# EAGLE design raspberry_pi_v002 (EAGLE 9.5.2)
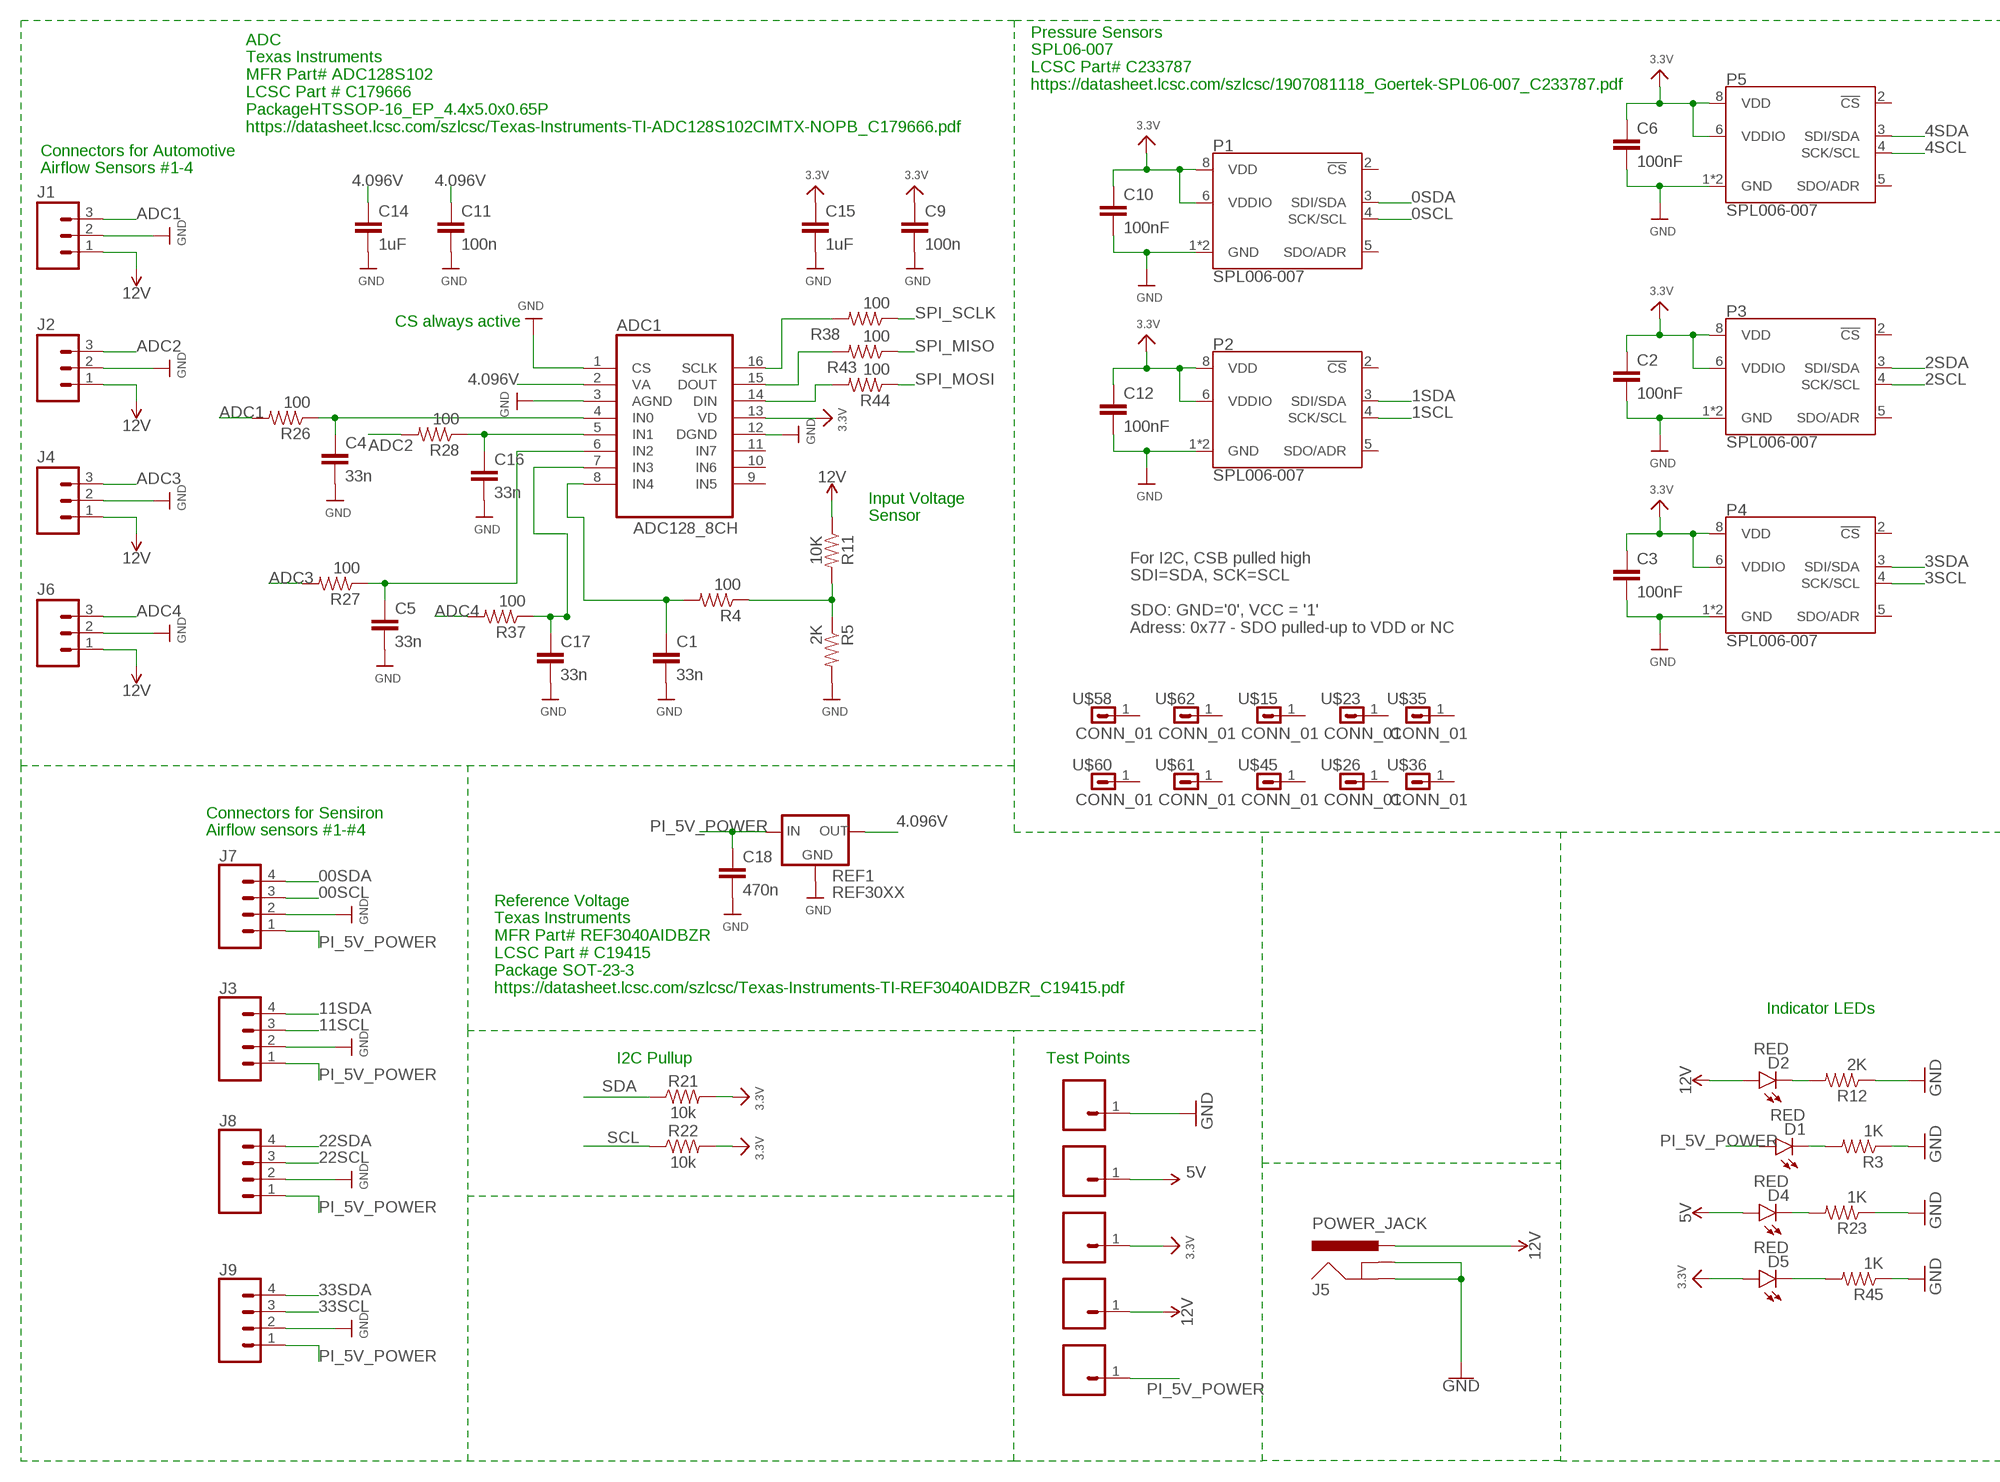
[diagram p0: schematic, sheet 1, part 1 of 2]
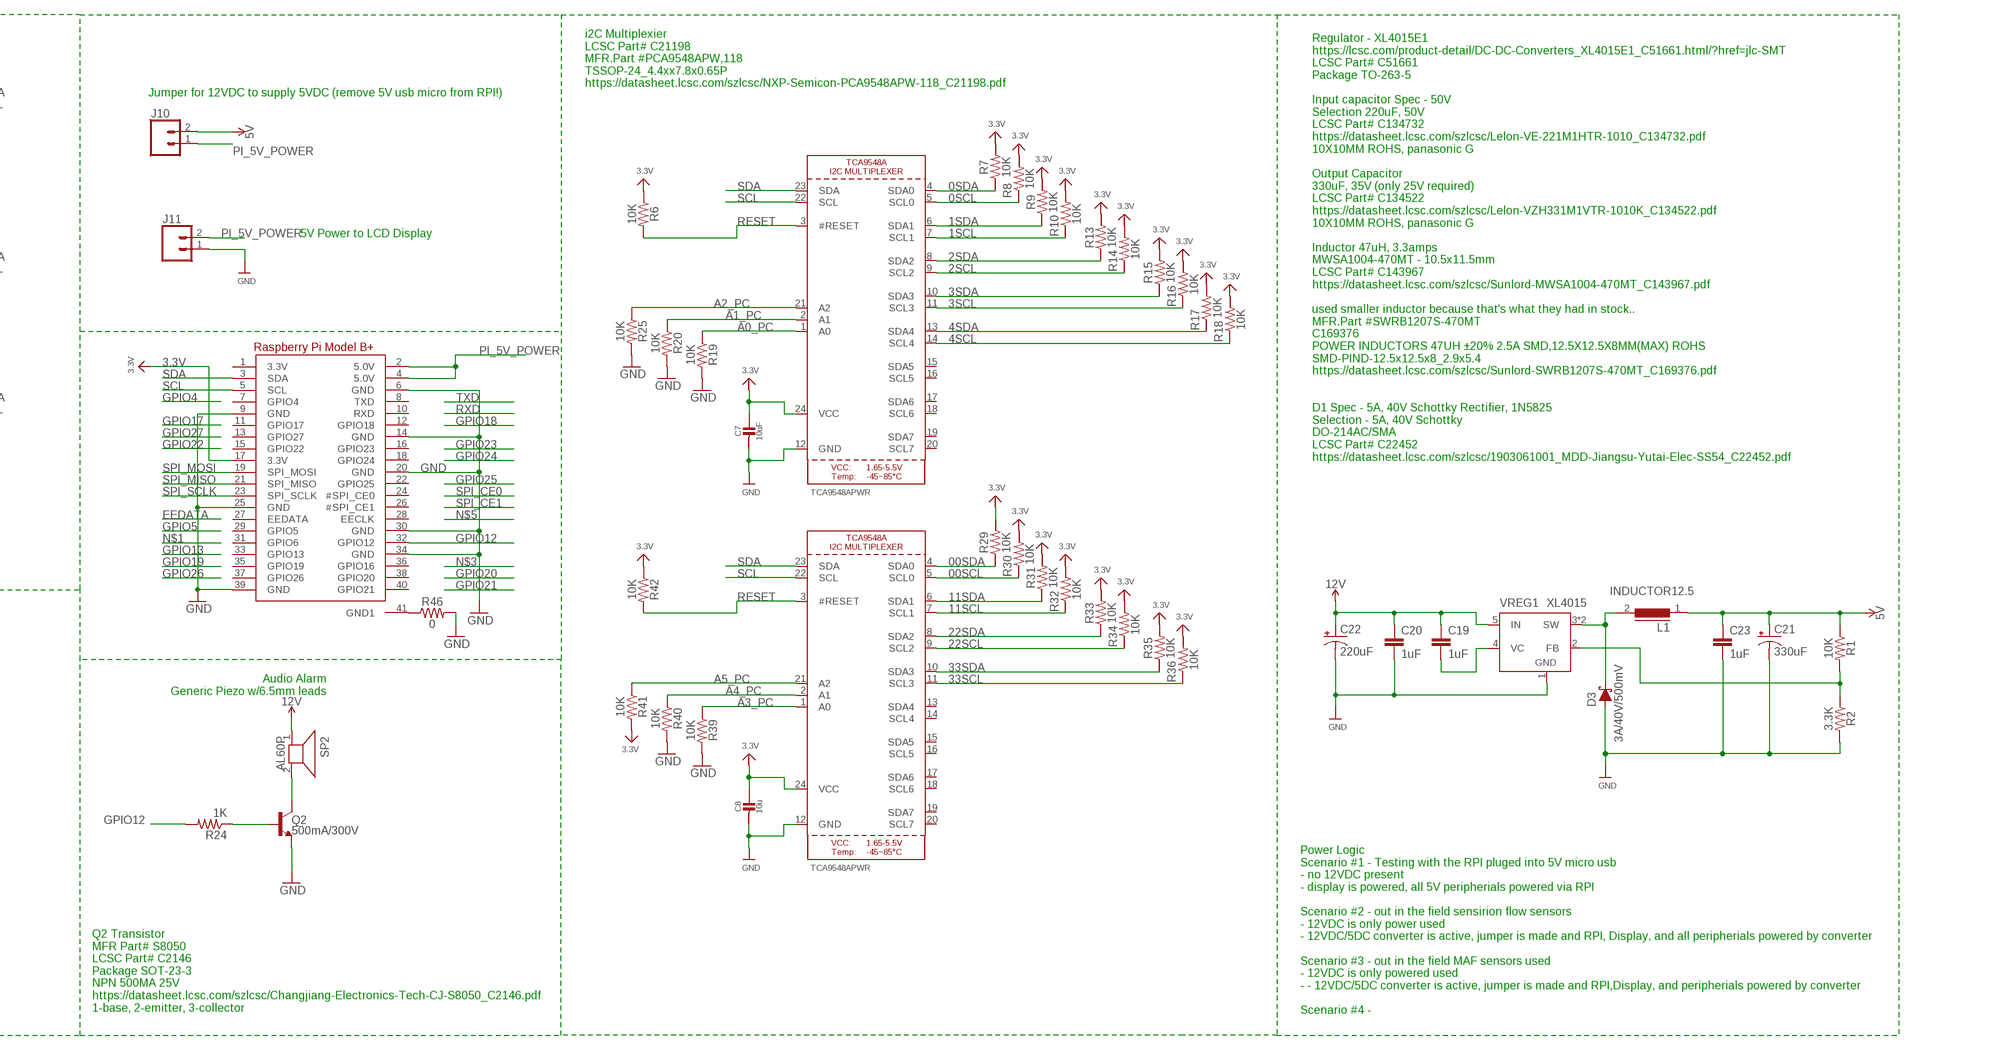
[diagram p1: schematic, sheet 1, part 2 of 2]

## Parts
ADC1  ADC128_8CH  [TSSOP16]
C1  33n  CAP-0805  [0805]
C2  100nF  CAP-0805  [0805]
C3  100nF  CAP-0805  [0805]
C4  33n  CAP-0805  [0805]
C5  33n  CAP-0805  [0805]
C6  100nF  CAP-0805  [0805]
C7  10uF  CAP_CERAMIC0805-NOOUTLINE  [0805-NO]
C8  10u  CAP_CERAMIC0805-NOOUTLINE  [0805-NO]
C9  100n  CAP-0805  [0805]
C10  100nF  CAP-0805  [0805]
C11  100n  CAP-0805  [0805]
C12  100nF  CAP-0805  [0805]
C14  1uF  CAP-0805  [0805]
C15  1uF  CAP-0805  [0805]
C16  33n  CAP-0805  [0805]
C17  33n  CAP-0805  [0805]
C18  470n  CAP-0805  [0805]
C19  1uF  CAP-0805  [0805]
C20  1uF  CAP-0805  [0805]
C21  330uF  560UF-PANASONIC_G-25V-20%  [PANASONIC_G]
C22  220uF  560UF-PANASONIC_G-25V-20%  [PANASONIC_G]
C23  1uF  CAP-0805  [0805]
D1  RED  LED-RED1206  [LED-1206]
D2  RED  LED-RED1206  [LED-1206]
D3  3A/40V/500mV  DIODE-SCHOTTKY-B340A  [SMA-DIODE]
D4  RED  LED-RED1206  [LED-1206]
D5  RED  LED-RED1206  [LED-1206]
J1  M03SCREW  [SCREWTERMINAL-3.5MM-3]
J2  M03SCREW  [SCREWTERMINAL-3.5MM-3]
J3  CONN_043.5MM_RA  [1X04_3.5MM_RA]
J4  M03SCREW  [SCREWTERMINAL-3.5MM-3]
J5  POWER_JACK  [POWER_JACK_PTH]
J6  M03SCREW  [SCREWTERMINAL-3.5MM-3]
J7  CONN_043.5MM_RA  [1X04_3.5MM_RA]
J8  CONN_043.5MM_RA  [1X04_3.5MM_RA]
J9  CONN_043.5MM_RA  [1X04_3.5MM_RA]
J10  CONN_02  [1X02]
J11  CONN_025MM  [SCREWTERMINAL-5MM-2]
L1  INDUCTOR12.5  [INDUCTOR_12.5X12.5]
P1  SPL006-007  [LGA-8-2.5X2.0]
P2  SPL006-007  [LGA-8-2.5X2.0]
P3  SPL006-007  [LGA-8-2.5X2.0]
P4  SPL006-007  [LGA-8-2.5X2.0]
P5  SPL006-007  [LGA-8-2.5X2.0]
Q2  500mA/300V  TRANS_NPN-MMBTA42  [SOT23-3]
R1  10K  0.3OHM-0805-1/8W-1%  [0805]
R2  3.3K  0.3OHM-0805-1/8W-1%  [0805]
R3  1K  RESISTOR0805-RES  [0805]
R4  100  RESISTOR0805-RES  [0805]
R5  2K  RESISTOR0805-RES  [0805]
R6  10K  0.3OHM-0805-1/8W-1%  [0805]
R7  10K  0.3OHM-0805-1/8W-1%  [0805]
R8  10K  0.3OHM-0805-1/8W-1%  [0805]
R9  10K  0.3OHM-0805-1/8W-1%  [0805]
R10  10K  0.3OHM-0805-1/8W-1%  [0805]
R11  10K  0.3OHM-0805-1/8W-1%  [0805]
R12  2K  RESISTOR0805-RES  [0805]
R13  10K  0.3OHM-0805-1/8W-1%  [0805]
R14  10K  0.3OHM-0805-1/8W-1%  [0805]
R15  10K  0.3OHM-0805-1/8W-1%  [0805]
R16  10K  0.3OHM-0805-1/8W-1%  [0805]
R17  10K  0.3OHM-0805-1/8W-1%  [0805]
R18  10K  0.3OHM-0805-1/8W-1%  [0805]
R19  10K  0.3OHM-0805-1/8W-1%  [0805]
R20  10K  0.3OHM-0805-1/8W-1%  [0805]
R21  10k  0.3OHM-0805-1/8W-1%  [0805]
R22  10k  0.3OHM-0805-1/8W-1%  [0805]
R23  1K  RESISTOR0805-RES  [0805]
R24  1K  RESISTOR0805-RES  [0805]
R25  10K  0.3OHM-0805-1/8W-1%  [0805]
R26  100  RESISTOR0805-RES  [0805]
R27  100  RESISTOR0805-RES  [0805]
R28  100  RESISTOR0805-RES  [0805]
R29  10K  0.3OHM-0805-1/8W-1%  [0805]
R30  10K  0.3OHM-0805-1/8W-1%  [0805]
R31  10K  0.3OHM-0805-1/8W-1%  [0805]
R32  10K  0.3OHM-0805-1/8W-1%  [0805]
R33  10K  0.3OHM-0805-1/8W-1%  [0805]
R34  10K  0.3OHM-0805-1/8W-1%  [0805]
R35  10K  0.3OHM-0805-1/8W-1%  [0805]
R36  10K  0.3OHM-0805-1/8W-1%  [0805]
R37  100  RESISTOR0805-RES  [0805]
R38  100  RESISTOR0805-RES  [0805]
R39  10K  0.3OHM-0805-1/8W-1%  [0805]
R40  10K  0.3OHM-0805-1/8W-1%  [0805]
R41  10K  0.3OHM-0805-1/8W-1%  [0805]
R42  10K  0.3OHM-0805-1/8W-1%  [0805]
R43  100  RESISTOR0805-RES  [0805]
R44  100  RESISTOR0805-RES  [0805]
R45  1K  RESISTOR0805-RES  [0805]
R46  0  0.3OHM-0805-1/8W-1%  [0805]
REF1  REF30XX  [SOT23-3]
RPI2  MICROBUILDER_RASPBERRYPI_BPLUS_HATSLOTS  [MICROBUILDER_PI_HAT_SLOTS]
SP2  AL60P  [AL60P]
U6  TCA9548APWR  TCA9548A  [TSSOP24]
U7  TCA9548APWR  TCA9548A  [TSSOP24]
U$15  CONN_01  [1X01-#6_MACHINE]
U$20  CONN_0138MILL  [1X01-40MILL]
U$23  CONN_01  [1X01-#6_MACHINE]
U$26  CONN_01  [1X01-#6_MACHINE]
U$31  CONN_0138MILL  [1X01-40MILL]
U$35  CONN_01  [1X01-#6_MACHINE]
U$36  CONN_01  [1X01-#6_MACHINE]
U$40  CONN_0138MILL  [1X01-40MILL]
U$45  CONN_01  [1X01-#6_MACHINE]
U$58  CONN_01  [1X01-#6_MACHINE]
U$59  CONN_0138MILL  [1X01-40MILL]
U$60  CONN_01  [1X01-#6_MACHINE]
U$61  CONN_01  [1X01-#6_MACHINE]
U$62  CONN_01  [1X01-#6_MACHINE]
U$64  CONN_0138MILL  [1X01-40MILL]
VREG1  XL4015  [TO263-5]

## Nets
0SCL: P1.4(SCK/SCL) R8.1 U6.5(SCL0)
00SCL: J7.3 R30.1 U7.5(SCL0)
0SDA: P1.3(SDI/SDA) R7.1 U6.4(SDA0)
00SDA: J7.4 R29.1 U7.4(SDA0)
1SCL: P2.4(SCK/SCL) R10.1 U6.7(SCL1)
1SDA: P2.3(SDI/SDA) R9.1 U6.6(SDA1)
2SCL: P3.4(SCK/SCL) R14.1 U6.9(SCL2)
2SDA: P3.3(SDI/SDA) R13.1 U6.8(SDA2)
3.3V: ADC1.13(VD) C2.1 C3.1 C6.1 C7.1 C8.1 C9.1 C10.1 C12.1 C15.1 D5.A P1.6(VDDIO) P1.8(VDD) P2.6(VDDIO) P2.8(VDD) P3.6(VDDIO) P3.8(VDD) P4.6(VDDIO) P4.8(VDD) P5.6(VDDIO) P5.8(VDD) R6.1 R7.2 R8.2 R9.2 R10.2 R13.2 R14.2 R15.2 R16.2 R17.2 R18.2 R21.2 R22.2 R29.2 R30.2 R31.2 R32.2 R33.2 R34.2 R35.2 R36.2 R41.2 R42.1 RPI2.17(3.3V) U6.24(VCC) U7.24(VCC) U$20.1
3SCL: P4.4(SCK/SCL) R16.1 U6.11(SCL3)
3SDA: P4.3(SDI/SDA) R15.1 U6.10(SDA3)
4.096V: ADC1.2(VA) C11.1 C14.1 REF1.2(OUT)
4SCL: P5.4(SCK/SCL) R18.1 U6.14(SCL4)
4SDA: P5.3(SDI/SDA) R17.1 U6.13(SDA4)
5V: C21.+ C23.1 D4.A J10.2 L1.1 R1.1 U$59.1
11SCL: J3.3 R32.1 U7.7(SCL1)
11SDA: J3.4 R31.1 U7.6(SDA1)
12V: C19.1 C20.1 C22.+ D2.A J1.1 J2.1 J4.1 J5.PWR J6.1 R11.1 SP2.1 U$40.1 VREG1.5(IN)
22SCL: J8.3 R34.1 U7.9(SCL2)
22SDA: J8.4 R33.1 U7.8(SDA2)
33SCL: J9.3 R36.1 U7.11(SCL3)
33SDA: J9.4 R35.1 U7.10(SDA3)
A0_PC: R19.1 U6.1(A0)
A1_PC: R20.1 U6.2(A1)
A2_PC: R25.1 U6.21(A2)
A3_PC: R39.1 U7.1(A0)
A4_PC: R40.1 U7.2(A1)
A5_PC: R41.1 U7.21(A2)
ADC1: J1.3 R26.2
ADC2: J2.3 R28.2
ADC3: J4.3 R27.2
ADC4: J6.3 R37.2
GND: ADC1.1(CS) ADC1.3(AGND) ADC1.12(DGND) C1.2 C2.2 C3.2 C4.2 C5.2 C6.2 C7.2 C8.2 C9.2 C10.2 C11.2 C12.2 C14.2 C15.2 C16.2 C17.2 C18.2 C20.2 C21.- C22.- C23.2 D3.A J1.2 J2.2 J3.2 J4.2 J5.GND J5.GNDBREAK J6.2 J7.2 J8.2 J9.2 J11.1 P1.1(GND) P1.7(GND) P2.1(GND) P2.7(GND) P3.1(GND) P3.7(GND) P4.1(GND) P4.7(GND) P5.1(GND) P5.7(GND) Q2.2(E) R2.2 R3.1 R5.2 R12.1 R19.2 R20.2 R23.1 R25.2 R39.2 R40.2 R45.1 R46.2 REF1.3(GND) RPI2.6(GND) RPI2.9(GND) RPI2.14(GND) RPI2.20(GND) RPI2.25(GND) RPI2.30(GND) RPI2.34(GND) RPI2.39(GND) U6.12(GND) U7.12(GND) U$31.1 VREG1.1(GND)
GND1: R46.1 RPI2.41(GND1)
GPIO12: R24.2 RPI2.32(GPIO12)
N$2: D2.C R12.2
N$6: D3.C L1.2 VREG1.3(SW) VREG1.6(SW)
N$7: C19.2 VREG1.4(VC)
N$8: D1.C R3.2
N$9: Q2.3(C) SP2.2
N$10: Q2.1(B) R24.1
N$11: R1.2 R2.1 VREG1.2(FB)
N$12: ADC1.8(IN4) C1.1 R4.2
N$13: R4.1 R5.1 R11.2
N$15: D4.C R23.2
N$16: D5.C R45.2
N$18: ADC1.4(IN0) C4.1 R26.1
N$19: ADC1.6(IN2) C5.1 R27.1
N$20: ADC1.5(IN1) C16.1 R28.1
N$22: ADC1.7(IN3) C17.1 R37.1
N$23: ADC1.16(SCLK) R38.2
N$24: ADC1.15(DOUT) R43.2
N$25: ADC1.14(DIN) R44.2
PI_5V_POWER: C18.1 D1.A J3.1 J7.1 J8.1 J9.1 J10.1 J11.2 REF1.1(IN) RPI2.2(5.0V) RPI2.4(5.0V) U$64.1
RESET: R6.2 R42.2 U6.3(#RESET) U7.3(#RESET)
SCL: R22.1 RPI2.5(SCL) U6.22(SCL) U7.22(SCL)
SDA: R21.1 RPI2.3(SDA) U6.23(SDA) U7.23(SDA)
SPI_MISO: R43.1 RPI2.21(SPI_MISO)
SPI_MOSI: R44.1 RPI2.19(SPI_MOSI)
SPI_SCLK: R38.1 RPI2.23(SPI_SCLK)
Unconnected: ADC1.9(IN5) ADC1.10(IN6) ADC1.11(IN7) P1.2(!CS) P1.5(SDO/ADR) P2.2(!CS) P2.5(SDO/ADR) P3.2(!CS) P3.5(SDO/ADR) P4.2(!CS) P4.5(SDO/ADR) P5.2(!CS) P5.5(SDO/ADR) RPI2.1(3.3V) RPI2.7(GPIO4) RPI2.8(TXD) RPI2.10(RXD) RPI2.11(GPIO17) RPI2.12(GPIO18) RPI2.13(GPIO27) RPI2.15(GPIO22) RPI2.16(GPIO23) RPI2.18(GPIO24) RPI2.22(GPIO25) RPI2.24(#SPI_CE0) RPI2.26(#SPI_CE1) RPI2.27(EEDATA) RPI2.28(EECLK) RPI2.29(GPIO5) RPI2.31(GPIO6) RPI2.33(GPIO13) RPI2.35(GPIO19) RPI2.36(GPIO16) RPI2.37(GPIO26) RPI2.38(GPIO20) RPI2.40(GPIO21) U6.15(SDA5) U6.16(SCL5) U6.17(SDA6) U6.18(SCL6) U6.19(SDA7) U6.20(SCL7) U7.13(SDA4) U7.14(SCL4) U7.15(SDA5) U7.16(SCL5) U7.17(SDA6) U7.18(SCL6) U7.19(SDA7) U7.20(SCL7) U$15.1 U$23.1 U$26.1 U$35.1 U$36.1 U$45.1 U$58.1 U$60.1 U$61.1 U$62.1

## Notes on the sheet
- ADC
  Texas Instruments
  MFR Part# ADC128S102
  LCSC Part # C179666
  PackageHTSSOP-16_EP_4.4x5.0x0.65P
  https://datasheet.lcsc.com/szlcsc/Texas-Instruments-TI-ADC128S102CIMTX-NOPB_C179666.pdf
- Pressure Sensors
  SPL06-007
  LCSC Part# C233787
  https://datasheet.lcsc.com/szlcsc/1907081118_Goertek-SPL06-007_C233787.pdf
- i2C Multiplexier
  LCSC Part# C21198
  MFR.Part #PCA9548APW,118
  TSSOP-24_4.4xx7.8x0.65P
  https://datasheet.lcsc.com/szlcsc/NXP-Semicon-PCA9548APW-118_C21198.pdf
- Jumper for 12VDC to supply 5VDC (remove 5V usb micro from RPI!)
- Connectors for Automotive 
  Airflow Sensors #1-4
- CS always active
- 5V Power to LCD Display
- Input Voltage 
  Sensor
- For I2C, CSB pulled high
  SDI=SDA, SCK=SCL
  
  SDO: GND='0', VCC = '1'
  Adress: 0x77 - SDO pulled-up to VDD or NC
- Regulator - XL4015E1
  https://lcsc.com/product-detail/DC-DC-Converters_XL4015E1_C51661.html/?href=jlc-SMT
  LCSC Part# C51661
  Package TO-263-5
  
  Input capacitor Spec - 50V
  Selection 220uF, 50V
  LCSC Part# C134732
  https://datasheet.lcsc.com/szlcsc/Lelon-VE-221M1HTR-1010_C134732.pdf
  10X10MM ROHS, panasonic G
  
  Output Capacitor
  330uF, 35V (only 25V required)
  LCSC Part# C134522
  https://datasheet.lcsc.com/szlcsc/Lelon-VZH331M1VTR-1010K_C134522.pdf
  10X10MM ROHS, panasonic G
  
  Inductor 47uH, 3.3amps
  MWSA1004-470MT - 10.5x11.5mm
  LCSC Part# C143967
  https://datasheet.lcsc.com/szlcsc/Sunlord-MWSA1004-470MT_C143967.pdf
  
  used smaller inductor because that's what they had in stock..
  MFR.Part #SWRB1207S-470MT
  C169376
  POWER INDUCTORS 47UH ±20% 2.5A SMD,12.5X12.5X8MM(MAX) ROHS
  SMD-PIND-12.5x12.5x8_2.9x5.4
  https://datasheet.lcsc.com/szlcsc/Sunlord-SWRB1207S-470MT_C169376.pdf
  
  
  D1 Spec - 5A, 40V Schottky Rectifier, 1N5825
  Selection - 5A, 40V Schottky
  DO-214AC/SMA
  LCSC Part# C22452
  https://datasheet.lcsc.com/szlcsc/1903061001_MDD-Jiangsu-Yutai-Elec-SS54_C22452.pdf
- Connectors for Sensiron
  Airflow sensors #1-#4
- Reference Voltage
  Texas Instruments
  MFR Part# REF3040AIDBZR
  LCSC Part # C19415
  Package SOT-23-3
  https://datasheet.lcsc.com/szlcsc/Texas-Instruments-TI-REF3040AIDBZR_C19415.pdf
- Audio Alarm
  Generic Piezo w/6.5mm leads
- Indicator LEDs
- I2C Pullup | Test Points
- Q2 Transistor
  MFR Part# S8050
  LCSC Part# C2146
  Package SOT-23-3
  NPN 500MA 25V
  https://datasheet.lcsc.com/szlcsc/Changjiang-Electronics-Tech-CJ-S8050_C2146.pdf
  1-base, 2-emitter, 3-collector
- Power Logic
  Scenario #1 - Testing with the RPI pluged into 5V micro usb
  - no 12VDC present
  - display is powered, all 5V peripherials powered via RPI
  
  Scenario #2 - out in the field sensirion flow sensors
  - 12VDC is only power used
  - 12VDC/5DC converter is active, jumper is made and RPI, Display, and all peripherials powered by converter
  
  Scenario #3 - out in the field MAF sensors used
  - 12VDC is only powered used
  - - 12VDC/5DC converter is active, jumper is made and RPI,Display, and peripherials powered by converter
  
  Scenario #4 -

## Library data of the parts
ADC1 = th_libraries:ADC128_8CH: ADC128S102 12-bit, 8 Channel ADC http://www.ti.com/lit/ds/symlink/adc128s102.pdf?HQS=TI-null-null-digikeymode-df-pf-null-wwe&ts=1591294747607 https://www.digikey.com/product-detail/en/texas-instruments/ADC128S102CIMTX-NOPB/296-41184-1-ND/5222639
C1-C6 C9-C12 C14-C20 C23 = SparkFun-Capacitors:CAP
C7 C8 = microbuilder:CAP_CERAMIC: Ceramic Capacitors For new designs, use the packages preceded by an '_' character since they are more reliable: The following footprints should be used on most boards: _0402 - Standard footprint for regular board layouts _0603 - Standard footprint for regular board layouts _0805 - Standard footprint for regular board layouts _1206 - Standard footprint for regular board layouts For extremely tight-pitch boards where space is at a premium, the following 'micro-pitch' footprints can be used (smaller pads, no silkscreen outline, etc.): _0402MP - Micro-pitch footprint for very dense/compact boards _0603MP - Micro-pitch footprint for very dense/compact boards _0805MP - Micro-pitch footprint for very dense/compact boards _1206MP - Micro-pitch footprint for very dense/compact boards
C21 C22 = SparkFun-Capacitors:560UF: 560µF polarized capacitors A capacitor is a passive two-terminal electrical component used to store electrical energy temporarily in an electric field.; PROD_ID: CAP-09983; VALUE: 560uF
D1 D2 D4 D5 = SparkFun-LED:LED-RED: Red SMD LED Used in manufacturing of most products at SparkFun Packages: 0603 - SMD 0603 package [Product Link] <http://docs.avagotech.com/docs/AV02-0551EN> 0603 SMART - SMD 0603 SMART package ( more efficient and expensive)[Product Link] <http://www.osram-os.com/Graphics/XPic2/00077099_0.pdf> 1206 - SMD1206 package [Product Link] <https://www.sparkfun.com/datasheets/DevTools/LilyPad/Q150OVS4.pdff> SparkFun Products: Pro Mini 328 -5V <https://www.sparkfun.com/products/821> RedBoard <https://www.sparkfun.com/products/12757> IOIO-OTG <https://www.sparkfun.com/products/13613>; PROD_ID: DIO-09912
D3 = SparkFun-DiscreteSemi:DIODE-SCHOTTKY: Schottky diode A Schottky diode is a semiconductor diode which has a low forward voltage drop and a very fast switching action.; PROD_ID: DIO-09886
J1 J2 J4 J6 = SparkFun-Connectors:M03: Header 3 Standard 3-pin 0.1" header. Use with straight break away headers (SKU : PRT-00116), right angle break away headers (PRT-00553), swiss pins (PRT-00743), machine pins (PRT-00117), and female headers (PRT-00115). Molex polarized connector foot print use with SKU : PRT-08232 with associated crimp pins and housings.; PROD_ID: CONN-08288
J3 J7-J9 = th_libraries:CONN_04: Multi connection point. Often used as Generic Header-pin footprint for 0.1 inch spaced/style header connections On any of the 0.1 inch spaced packages, you can populate with these: Break Away Headers - Straight <https://www.sparkfun.com/products/116> (PRT-00116) Break Away Male Headers - Right Angle <https://www.sparkfun.com/products/553> (PRT-00553) Female Headers <https://www.sparkfun.com/products/115> (PRT-00115) Break Away Headers - Machine Pin <https://www.sparkfun.com/products/117> (PRT-00117) Break Away Female Headers - Swiss Machine Pin <https://www.sparkfun.com/products/743> (PRT-00743) For SCREWTERMINALS and SPRING TERMINALS visit here: Screw Terimnals on SparkFun.com <https://www.sparkfun.com/search/results?term=Screw+Terminals> (5mm/3.5mm/2.54mm spacing) This device is also useful as a general connection point to wire up your design to another part of your project. Our various solder wires solder well into these plated through hole pads. Hook-Up Wire - Assortment (Stranded, 22 AWG) <https://www.sparkfun.com/products/11375> (PRT-11375) Hook-Up Wire - Assortment (Solid Core, 22 AWG) <https://www.sparkfun.com/products/11367> (PRT-11367) View the entire wire category on our website here <https://www.sparkfun.com/categories/141> Special notes: Molex polarized connector foot print use with SKU : PRT-08231 with associated crimp pins and housings. 1MM SMD Version SKU: PRT-10208
J5 = SparkFun-Connectors:POWER_JACK: Power Jack Connector This is the standard 5.5mm barrel jack for power. The PTH is the most common, proven, reliable, footprint. The Slot footprint only works if the mill layer is transmitted to the PCB fab house so be warned. Here are the connectors we sell at SparkFun: DC Barrel Power Jack/Connector <https://www.sparkfun.com/products/119> (PRT-00119) DC Barrel Power Jack/Connector (SMD) <https://www.sparkfun.com/products/12748> (PRT-12748) DC Barrel Jack Adapter - Breadboard Compatible <https://www.sparkfun.com/products/10811> (PRT-10811) It is used on this SparkFun product (and many, many others): SparkFun RedBoard - Programmed with Arduino <https://www.sparkfun.com/products/12757> (DEV-12757) Also, if you need a mating power supply or connector, please check these out: Wall Adapter Power Supply - 9VDC 650mA <https://www.sparkfun.com/products/298> (TOL-00298) DC Barrel Jack Adapter - Male <https://www.sparkfun.com/products/10287> (PRT-10287); PROD_ID: CONN-08197
J10 = SparkFun-Connectors:CONN_02: Multi connection point. Often used as Generic Header-pin footprint for 0.1 inch spaced/style header connections On any of the 0.1 inch spaced packages, you can populate with these: Break Away Headers - Straight <https://www.sparkfun.com/products/116> (PRT-00116) Break Away Male Headers - Right Angle <https://www.sparkfun.com/products/553> (PRT-00553) Female Headers <https://www.sparkfun.com/products/115> (PRT-00115) Break Away Headers - Machine Pin <https://www.sparkfun.com/products/117> (PRT-00117) Break Away Female Headers - Swiss Machine Pin <https://www.sparkfun.com/products/743> (PRT-00743) For SCREWTERMINALS and SPRING TERMINALS visit here: Screw Terimnals on SparkFun.com <https://www.sparkfun.com/search/results?term=Screw+Terminals> (5mm/3.5mm/2.54mm spacing) This device is also useful as a general connection point to wire up your design to another part of your project. Our various solder wires solder well into these plated through hole pads. Hook-Up Wire - Assortment (Stranded, 22 AWG) <https://www.sparkfun.com/products/11375> (PRT-11375) Hook-Up Wire - Assortment (Solid Core, 22 AWG) <https://www.sparkfun.com/products/11367> (PRT-11367) View the entire wire category on our website here <https://www.sparkfun.com/categories/141> Special notes: Molex polarized connector foot print use with: PRT-08233 with associated crimp pins and housings. 2.54_SCREWTERM for use with PRT-10571. 3.5mm Screw Terminal footprints for PRT-08084 5mm Screw Terminal footprints for use with PRT-08432
J11 = SparkFun-Connectors:CONN_02: Multi connection point. Often used as Generic Header-pin footprint for 0.1 inch spaced/style header connections On any of the 0.1 inch spaced packages, you can populate with these: Break Away Headers - Straight <https://www.sparkfun.com/products/116> (PRT-00116) Break Away Male Headers - Right Angle <https://www.sparkfun.com/products/553> (PRT-00553) Female Headers <https://www.sparkfun.com/products/115> (PRT-00115) Break Away Headers - Machine Pin <https://www.sparkfun.com/products/117> (PRT-00117) Break Away Female Headers - Swiss Machine Pin <https://www.sparkfun.com/products/743> (PRT-00743) For SCREWTERMINALS and SPRING TERMINALS visit here: Screw Terimnals on SparkFun.com <https://www.sparkfun.com/search/results?term=Screw+Terminals> (5mm/3.5mm/2.54mm spacing) This device is also useful as a general connection point to wire up your design to another part of your project. Our various solder wires solder well into these plated through hole pads. Hook-Up Wire - Assortment (Stranded, 22 AWG) <https://www.sparkfun.com/products/11375> (PRT-11375) Hook-Up Wire - Assortment (Solid Core, 22 AWG) <https://www.sparkfun.com/products/11367> (PRT-11367) View the entire wire category on our website here <https://www.sparkfun.com/categories/141> Special notes: Molex polarized connector foot print use with: PRT-08233 with associated crimp pins and housings. 2.54_SCREWTERM for use with PRT-10571. 3.5mm Screw Terminal footprints for PRT-08084 5mm Screw Terminal footprints for use with PRT-08432; SF_SKU: PRT-08432
L1 = th_libraries:INDUCTOR
P1-P5 = th_libraries:SPL006-007: Goertek SPL06-007 – Combined Humidity and Pressure Sensor The SPL06-007 is as combined digital humidity, pressure and temperature sensor.. The sensor module is housed in an extremely compact metal-lid LGA package with a footprint of only 2.5×2.0mm² with a height of 0.95mm. . Datasheet <https://datasheet.lcsc.com/szlcsc/1907081118_Goertek-SPL06-007_C233787.pdf>
Q2 = SparkFun-DiscreteSemi:TRANS_NPN: NPN transistor Current controlled devices typically used to amplify current or used as a switch. BC547 - COM-08928 <http://www.sparkfun.com/products/8928> (TO-92 45V 100mA) (1.Collector 2.Base 3.Emitter) 2N3904 - COM-00521 <http://www.sparkfun.com/products/521> (TO-92 40V 200mA) (1.Emitter 2.Base 3.Collector) P2N2222A - COM-12852 <http://www.sparkfun.com/products/12852> (TO-92 40V 600mA) (1.Collector 2.Base 3.Emitter); PROD_ID: TRANS-09116
R1 R2 R6-R11 R13-R22 R25 R29-R36 R39-R42 R46 = SparkFun-Resistors:0.3OHM: 0.3Ω resistor A resistor is a passive two-terminal electrical component that implements electrical resistance as a circuit element. Resistors act to reduce current flow, and, at the same time, act to lower voltage levels within circuits. - Wikipedia; PROD_ID: RES-11622; VALUE: 0.3
R3-R5 R12 R23 R24 R26-R28 R37 R38 R43-R45 = SparkFun-Passives:RESISTOR: Resistor Basic schematic elements and footprints for 0603, 1206, and PTH resistors.
REF1 = th_libraries:REF30XX: Voltage Reference REF3012 - 1.25V REF3020 - 2.048V REF3025 - 2.5V REF3030 - 3.0V REF3033 - 3.3V REF3040 - 4.096V REF3040AIDBZR https://www.digikey.com/product-detail/en/texas-instruments/REF3040AIDBZR/296-35920-1-ND/4135041
RPI2 = pi_hat_with_ground_pin:MICROBUILDER_RASPBERRYPI_BPLUS
SP2 = buzzer:AL60P: SPEAKER Source: Buerklin; OC_FARNELL: unknown; OC_NEWARK: unknown
U6 U7 = microbuilder:TCA9548A: TCA9548A I2C Multiplexer
U$15 U$23 U$26 U$35 U$36 U$45 U$58 U$60-U$62 = th_libraries:CONN_01: #6 Machine Screw tite - 144mil hole, 256mil diameter
U$20 U$31 U$40 U$59 U$64 = th_libraries3:CONN_01: #6 Machine Screw tite - 144mil hole, 256mil diameter
VREG1 = th_libraries:XL4015: used in v002 raspberry pi ventilator by JLC SMT https://datasheet.lcsc.com/szlcsc/1811081616_XLSEMI-XL4015E1_C51661.pdf Manufacturer XLSEMI Mfr.Part # XL4015E1 LCSC Part # C51661 Package TO-263-5

## Net classes
1 highpower: width 0.305 mm, drill 0.483 mm
2 lowpower: width 0.305 mm, drill 0.483 mm

## Board
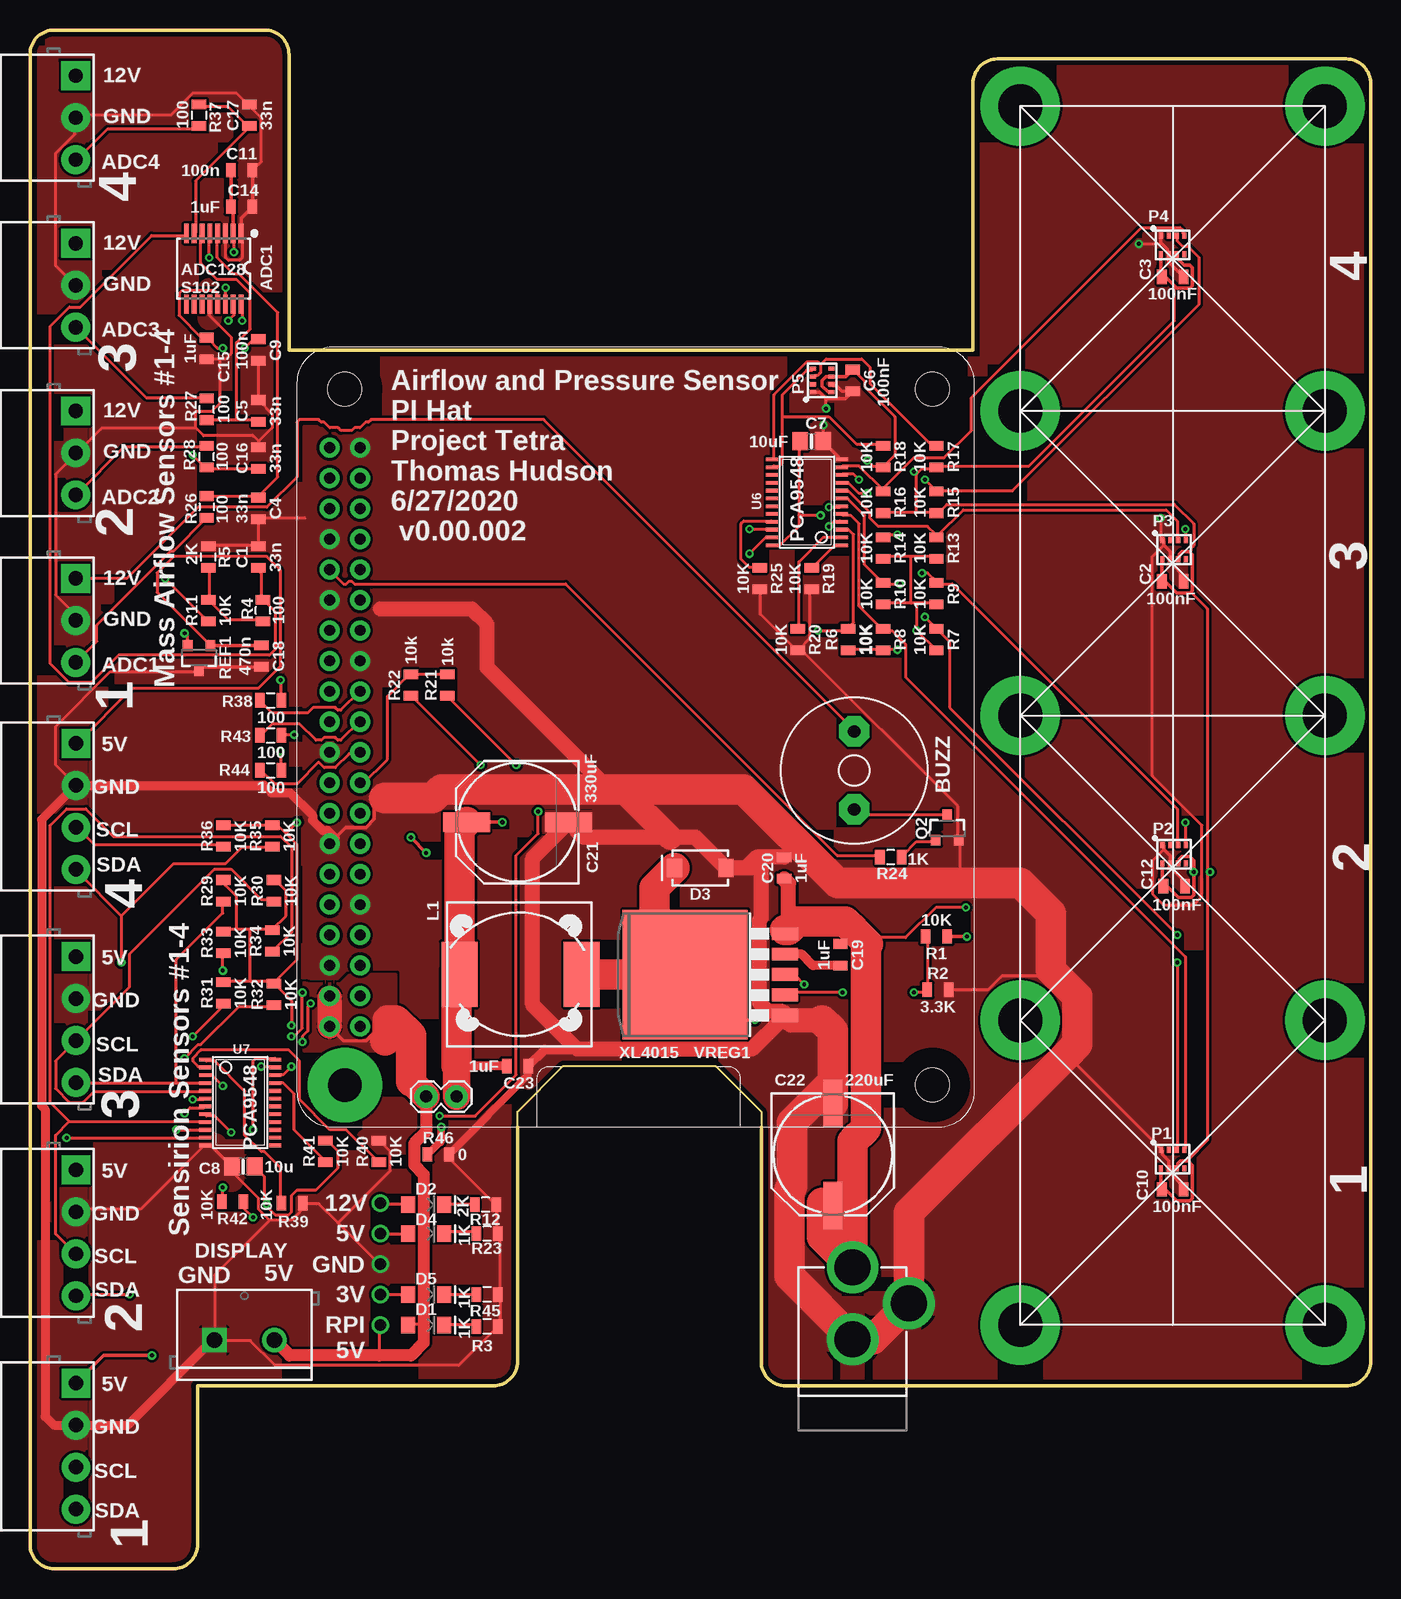
[diagram p2: board, top side]
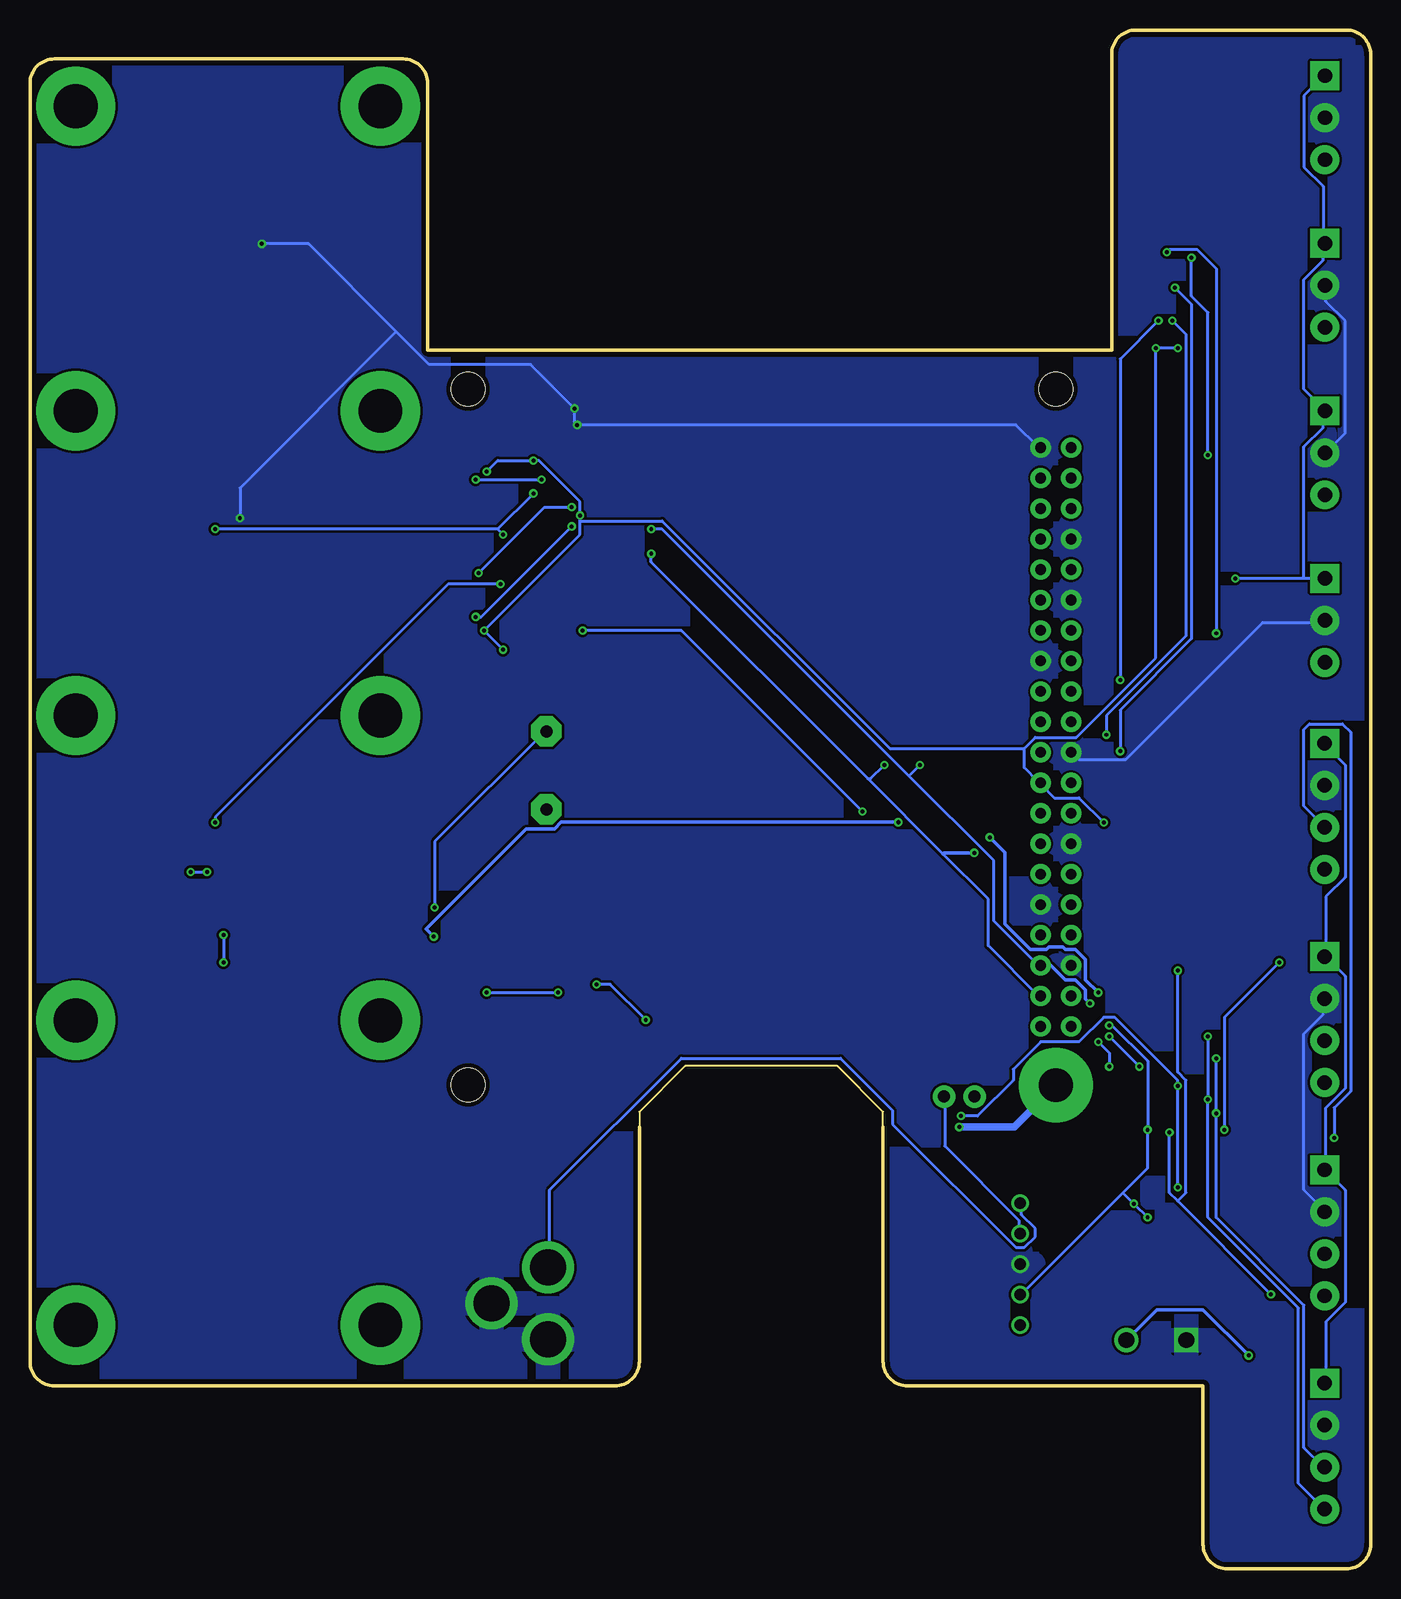
[diagram p3: board, bottom side, seen from below]

Size 111.76 x 128.27 mm. Coordinates in mm from the lower left corner, seen from the top.
Outline: 40.64,36.83 40.64,38.1 44.45,41.91 57.15,41.91 60.96,38.1 60.96,36.83 60.96,17.27 arc90 62.99,15.24 109.73,15.24 arc90 111.76,17.27 111.76,123.83 arc90 109.73,125.86 80.64,125.86 arc90 78.61,123.83 78.61,101.6 21.59,101.6 21.59,126.24 arc90 19.56,128.27 2.03,128.27 arc90 0,126.24 0,2.03 arc90 2.03,0 11.94,0 arc90 13.97,2.03 13.97,15.24 38.61,15.24 arc90 40.64,17.27 40.64,36.83
Copper layers (1*16): Top 0.0356mm / dielectric 1.5011mm / Bottom 0.0356mm
Design rules "LaenPCBOrder *": minimum track width 10mil, minimum drill 13mil, track to track 8mil, track to pad 8mil, pad to pad 8mil, via to via 8mil, smd to smd 6mil, copper to edge 15mil, drill to drill 6mil, minimum pad ring 7mil, minimum via ring 7mil, stop-mask expansion 3mil, vias tented up to drill 25mil, thermal gap 10mil

### Footprints (pad centres in the part's own frame; a part is rotated, then mirrored left to right if it is on the bottom)
TSSOP16 = smd 0.4 x 1.6: 1 -2.225,-2.85; 2 -1.575,-2.85; 3 -0.925,-2.85; 4 -0.275,-2.85; 5 0.375,-2.85; 6 1.025,-2.85; 7 1.675,-2.85; 8 2.325,-2.85; 9 2.325,3.05; 10 1.675,3.05; 11 1.025,3.05; 12 0.375,3.05; 13 -0.275,3.05; 14 -0.925,3.05; 15 -1.575,3.05; 16 -2.225,3.05
0805 = smd 0.8 x 1.2: 1 -0.9,0; 2 0.9,0
0805-NO = smd 1.3 x 1.5: 1 -0.95,0; 2 0.95,0
PANASONIC_G = smd 3.9 x 1.6: + 4.25,0; - -4.25,0
LED-1206 = smd 1.2 x 1.4: A -1.5,0; C 1.5,0
SMA-DIODE = smd 1.27 x 1.47: A -2.15,0; C 2.15,0
SCREWTERMINAL-3.5MM-3 = drill 1.2 pad 2.413 square: 1 0,0 | drill 1.2 pad 2.413: 2 3.5,0; 3 7,0
1X04_3.5MM_RA = drill 1.2 pad 2.413 square: 1 -0.228,0.023 | drill 1.2 pad 2.413: 2 3.272,0.023; 3 6.772,0.023; 4 10.272,0.023
POWER_JACK_PTH = drill 2.997 pad 4.318: GND 0,7.7; GNDBREAK 4.7,10.7; PWR 0,13.7
1X02 = drill 1.016 pad 1.88: 1 0,0; 2 2.54,0
SCREWTERMINAL-5MM-2 = drill 1.3 pad 2.032 square: 1 0,0 | drill 1.3 pad 2.032: 2 5,0
INDUCTOR_12.5X12.5 = smd 3 x 5.4: 1 -4.975,0.02; 2 5.225,0.02
LGA-8-2.5X2.0 = smd 0.5 x 0.35: 1 0.771,0.975; 2 0.771,0.325; 3 0.771,-0.325; 4 0.771,-0.975; 5 -0.779,-0.975; 6 -0.779,-0.325; 7 -0.779,0.325; 8 -0.779,0.975
SOT23-3 = smd 0.8 x 0.9: 1 -0.95,-1; 2 0.95,-1; 3 0,1.1
MICROBUILDER_PI_HAT_SLOTS = drill 0.9 pad 1.676: 1 8.37,51.23; 2 8.37,53.77; 3 10.91,51.23; 4 10.91,53.77; 5 13.45,51.23; 6 13.45,53.77; 7 15.99,51.23; 8 15.99,53.77; 9 18.53,51.23; 10 18.53,53.77; 11 21.07,51.23; 12 21.07,53.77; 13 23.61,51.23; 14 23.61,53.77; 15 26.15,51.23; 16 26.15,53.77; 17 28.69,51.23; 18 28.69,53.77; 19 31.23,51.23; 20 31.23,53.77; 21 33.77,51.23; 22 33.77,53.77; 23 36.31,51.23; 24 36.31,53.77; 25 38.85,51.23; 26 38.85,53.77; 27 41.39,51.23; 28 41.39,53.77; 29 43.93,51.23; 30 43.93,53.77; 31 46.47,51.23; 32 46.47,53.77; 33 49.01,51.23; 34 49.01,53.77; 35 51.55,51.23; 36 51.55,53.77; 37 54.09,51.23; 38 54.09,53.77; 39 56.63,51.23; 40 56.63,53.77 | drill 2.8 pad 6.198: 41 3.48,52.502 | hole 2.8: 3.5,3.5; 61.5,52.5; 61.5,3.5
AL60P = drill 1.016 pad 2.54 octagon: 1 -3.251,0; 2 3.251,0
TSSOP24 = smd 0.305 x 0.991: 1 -3.575,-2.918; 2 -2.925,-2.918; 3 -2.275,-2.918; 4 -1.625,-2.918; 5 -0.975,-2.918; 6 -0.325,-2.918; 7 0.325,-2.918; 8 0.975,-2.918; 9 1.625,-2.918; 10 2.275,-2.918; 11 2.925,-2.918; 12 3.575,-2.918; 13 3.575,2.918; 14 2.925,2.918; 15 2.275,2.918; 16 1.625,2.918; 17 0.975,2.918; 18 0.325,2.918; 19 -0.325,2.918; 20 -0.975,2.918; 21 -1.625,2.918; 22 -2.275,2.918; 23 -2.925,2.918; 24 -3.575,2.918
1X01-#6_MACHINE = drill 3.658 pad 6.604: 1 0,0
1X01-40MILL = drill 0.965 pad 1.397: 1 0,0
TO263-5 = smd 1.067 x 2.159: 1 -3.404,-5.791; 2 -1.702,-5.791; 3 0,-5.791; 4 1.702,-5.791; 5 3.404,-5.791 | smd 10.8 x 10.41: 6 0,2.54

### Placement (x,y rotation side)
ADC1  15.37,108.46 180 top
C1  19.05,84.33 90 top
C2  95.25,82.3 0 top
C3  95.25,107.7 0 top
C4  19.05,88.39 270 top
C5  19.05,96.52 90 top
C6  68.58,99.06 270 top
C7  65.15,93.98 0 top
C8  17.78,33.53 180 top
C9  19.05,101.6 270 top
C10  95.25,31.62 0 top
C11  17.65,116.59 0 top
C12  95.38,56.9 0 top
C14  17.65,113.54 0 top
C15  14.73,101.73 270 top
C16  19.05,92.58 90 top
C17  18.29,121.16 90 top
C18  19.3,76.07 270 top
C19  67.56,51.18 270 top
C20  62.86,58.42 90 top
C21  40.64,62.23 180 top
C22  66.93,34.54 270 top
C23  40.64,41.91 0 top
D1  33.02,20.32 0 top
D2  33.02,30.35 0 top
D3  55.88,58.42 180 top
D4  33.02,27.94 0 top
D5  33.02,22.86 0 top
J1  3.81,82.55 270 top
J2  3.81,96.52 270 top
J3  3.81,15.24 270 top
J4  3.81,110.49 270 top
J5  68.58,11.43 0 top
J6  3.81,124.46 270 top
J7  3.81,50.8 270 top
J8  3.81,33.02 270 top
J9  3.81,68.58 270 top
J10  33.02,39.37 0 top
J11  15.37,19.05 0 top
L1  40.77,49.53 0 top
P1  95.25,34.16 90 top
P2  95.38,59.56 90 top
P3  95.38,84.96 90 top
P4  95.25,110.36 90 top
P5  66.04,99.06 180 top
Q2  76.45,61.72 0 top
R1  75.56,52.71 180 top
R2  75.69,48.26 0 top
R3  38.1,20.19 180 top
R4  19.43,79.88 90 top
R5  14.86,84.33 90 top
R6  68.2,77.47 90 top
R7  75.56,77.47 270 top
R8  71.12,77.47 270 top
R9  75.56,81.28 270 top
R10  71.12,81.28 270 top
R11  14.86,79.88 90 top
R12  37.97,30.35 180 top
R13  75.56,85.09 270 top
R14  71.12,85.09 270 top
R15  75.56,88.9 270 top
R16  71.12,88.9 270 top
R17  75.56,92.71 270 top
R18  71.12,92.71 270 top
R19  65.15,82.55 270 top
R20  64.01,77.47 270 top
R21  34.8,73.66 90 top
R22  31.75,73.66 90 top
R23  38.1,27.94 180 top
R24  71.75,59.31 180 top
R25  60.83,82.55 270 top
R26  14.73,88.52 270 top
R27  14.73,96.65 90 top
R28  14.73,92.71 90 top
R29  16.13,56.52 90 top
R30  20.32,56.52 90 top
R31  16.13,48.01 90 top
R32  20.32,47.88 90 top
R33  16.13,52.2 90 top
R34  20.19,52.32 90 top
R35  20.19,61.09 90 top
R36  16.13,61.09 90 top
R37  14.1,121.16 270 top
R38  20.07,72.39 0 top
R39  21.84,30.48 0 top
R40  29.08,34.8 90 top
R41  24.64,34.8 90 top
R42  16.89,30.61 180 top
R43  20.07,69.47 0 top
R44  20.07,66.55 0 top
R45  38.1,22.86 180 top
R46  34.04,34.54 0 top
REF1  14.1,75.95 180 top
RPI2  78.74,36.83 90 top
SP2  68.71,66.55 270 top
U6  64.77,88.9 90 top
U7  17.53,38.86 270 top
U$15  82.55,45.72 90 top
U$20  29.21,22.86 90 top
U$23  107.95,20.32 90 top
U$26  82.55,121.92 90 top
U$31  29.21,25.4 90 top
U$35  82.55,20.32 90 top
U$36  107.95,121.92 90 top
U$40  29.21,30.48 90 top
U$45  107.95,45.72 90 top
U$58  82.55,96.52 90 top
U$59  29.21,27.94 180 top
U$60  107.95,96.52 90 top
U$61  82.55,71.12 90 top
U$62  107.95,71.12 90 top
U$64  29.21,20.32 0 top
VREG1  57.15,49.53 90 top

### Tracks (layer width: path | path; a pad name or v marks a point on that pad's centre or on a via)
0SCL
  Top 0.254: P1.4 96.32,35 96.32,51 73,74.32 73,77.06 71.86,78.21 71.17,78.21 R8.1 70.94,78.44 69.11,80.26 69.11,87.12 68.43,87.81 67.74,87.81 U6.5
00SCL
  Top 0.254: U7.5 14.48,39.8 5.33,39.8 4.42,38.89 3.28,38.89 2.13,40.03 2.13,42.32 3.73,43.92 J7.3 3.96,44.15 8.31,48.49 8.31,51.23 15.39,58.32 16.76,58.32 19.28,55.8 20.19,55.8 R30.1
0SDA  (via drill 0.33)
  Top 0.254: v95.63,50.55 95.63,35 P1.3 | v95.63,52.83 76.66,71.81 76.66,77.29 75.74,78.21 R7.1 75.51,78.44 v74.6,79.35 | v66.6,86.89 67.06,87.35 67.51,87.35 U6.4
  Bottom 0.254: v95.63,52.83 v95.63,50.55 | v66.6,86.89 74.14,79.35 v74.6,79.35
00SDA
  Top 0.254: 12.19,40.49 3.96,40.49 J7.4 | 12.19,40.49 14.48,40.49 U7.4 | 12.19,40.49 12.19,50.78 16.08,54.66 16.08,55.58 R29.1
1SCL  (via drill 0.33)
  Top 0.254: v96.32,62.21 96.32,60.38 P2.4 | v72.54,82.09 71.17,82.09 R10.1 70.94,82.32 69.57,83.69 69.57,87.81 68.2,89.18 67.74,89.18 U6.7
  Bottom 0.254: v96.32,62.21 96.32,62.66 76.89,82.09 v72.54,82.09
1SDA  (via drill 0.33)
  Top 0.254: P2.3 95.63,60.38 95.63,63.35 76.89,82.09 75.74,82.09 R9.1 75.51,82.32 74.83,83.01 v74.37,83.01 | v66.6,88.49 67.51,88.49 U6.6
  Bottom 0.254: v66.6,88.49 68.89,88.49 v74.37,83.01
2SCL  (via drill 0.33)
  Top 0.254: v96.32,86.67 96.32,85.75 P3.4 | v72.31,86.21 71.17,86.21 R14.1 | v69.8,89.64 69.11,89.64 68.2,90.55 67.74,90.55 U6.9
  Bottom 0.254: 72.77,86.67 v96.32,86.67 | v72.31,86.21 72.77,86.67 | 72.77,86.67 v69.8,89.64
2SDA
  Top 0.254: P3.3 95.63,85.75 95.63,87.35 94.72,88.27 77.8,88.27 75.74,86.21 R13.1 75.51,86.21 74.83,86.89 70.71,86.89 70.03,87.58 70.03,88.04 68.2,89.87 67.74,89.87 U6.8
3.3V  (via drill 0.33)
  Top 0.254: 19.74,30.2 19.51,30.43 19.51,32.72 18.82,33.4 C8.1 | 19.74,30.2 20.42,29.52 21.57,29.52 21.79,29.74 21.79,31.12 22.25,31.57 23.85,31.57 25.68,33.4 25.68,34.77 24.77,35.69 R41.2 | v18.59,36.6 18.59,42.32 18.82,42.55 20.42,42.55 U7.24 | v18.59,29.29 17.91,29.97 17.91,30.43 R42.1 | D5.A 31.39,22.89 29.34,22.89 U$20.1 | v19.74,30.43 19.74,30.2 | 20.19,53.29 18.36,53.29 | 18.36,53.29 17.22,53.29 | 17.22,53.29 16.31,53.29 R33.2 | 17.22,53.29 17.22,56.03 16.31,56.95 16.31,57.4 R29.2 | 20.19,53.29 21.34,54.43 21.34,56.49 20.42,57.4 R30.2 | 20.19,53.29 R34.2 | 20.19,61.98 16.31,61.98 R36.2 | 18.36,48.95 20.19,48.95 R32.2 | 18.36,48.95 16.31,48.95 R31.2 | 20.19,61.98 20.65,61.98 21.34,61.29 | 21.34,61.29 22.25,60.38 22.25,50.78 20.42,48.95 R32.2 | 20.19,61.98 R35.2 | 18.36,48.95 18.36,53.29 | ADC1.13 15.62,105.41 15.62,106.32 15.39,106.55 12.65,106.55 12.42,106.32 12.42,104.5 14.25,102.67 14.71,102.67 C15.1 14.94,102.44 15.62,101.75 v16.08,101.75 | v17.91,101.75 18.59,102.44 19.05,102.44 C9.1 | R21.2 34.59,74.55 31.85,74.55 R22.2 31.62,74.55 29.79,72.72 29.79,67.46 27.74,65.41 RPI2.17 | v22.25,62.21 21.34,61.29 | v21.79,45.29 21.79,47.35 20.42,48.72 R32.2 | 98.15,58.09 98.15,80.03 96.77,81.41 96.7,81.34 | 98.15,58.09 98.15,35.69 96.55,34.09 96.55,33.99 | 98.15,58.09 v98.37,58.09 | v97,58.09 97.03,58.09 | 64.08,87.81 64.08,93.98 C7.1 | 64.08,87.81 64.08,86.89 62.48,85.29 62.03,85.29 U6.24 | C6.1 68.66,99.92 69.57,99.01 69.57,98.55 72.08,96.04 72.08,92.84 71.17,91.92 R18.2 70.94,91.92 70.26,91.92 v69.8,92.38 | 73.46,84.38 75.51,84.38 R13.2 | 73.46,84.38 71.17,84.38 R14.2 | R6.1 68.2,76.61 70.94,76.61 R8.2 71.17,76.61 v72.31,76.61
  Top 0.254: 73.91,80.49 75.51,80.49 R9.2 | 73.91,80.49 73.46,80.49 | 73.46,80.49 71.17,80.49 R10.2 | 73.91,80.49 v73.91,78.21 75.51,76.61 R7.2 | 73.46,80.49 73.46,84.38 | v65.91,87.81 64.08,87.81 | 73.91,88.04 75.51,88.04 R15.2 75.74,88.04 76.43,88.72 95.4,88.72 97,87.12 97,85.29 96.77,85.06 96.77,84.84 96.7,84.76 | 73.91,88.04 71.17,88.04 R16.2 | 73.91,91.24 74.37,91.69 75.51,91.69 R17.2 75.74,91.92 83.29,91.92 95.4,104.04 95.4,106.78 95.48,106.86 | 73.91,88.04 73.91,91.24 | 73.91,91.24 v73.69,91.47
  Top 0.305: C6.1 68,99.39 P5.6 66.36,99.39 66.04,99.06 66.04,98.59 66.52,98.11 66.8,98.11 P5.8 | P4.8 94.28,107.77 C3.1 94.65,107.7 95.48,106.86 95.6,106.74 96.7,106.74 96.91,106.95 96.91,108.44 96.7,108.65 96.23,108.65 95.58,109.31 P4.6 | P3.8 94.35,84.13 C2.1 94.65,82.3 95.6,81.34 96.7,81.34 96.91,81.55 96.91,84.56 96.7,84.76 96.67,84.79 96.03,84.79 95.82,84.58 95.82,84.3 P3.6 | P2.8 94.4,56.97 C12.1 94.77,56.9 95.73,55.94 96.82,55.94 97.03,56.15 97.03,58.09 97.03,59.03 96.67,59.39 96.03,59.39 95.82,59.18 95.82,58.9 P2.6 | P1.8 94.28,31.7 C10.1 94.65,31.62 95.6,30.67 96.7,30.67 96.91,30.88 96.91,33.63 96.55,33.99 95.9,33.99 95.69,33.78 95.69,33.5 P1.6
  Bottom 0.254: 20.65,31.34 29.11,22.89 U$20.1 | 20.65,31.34 18.59,33.4 v18.59,36.6 18.59,42.32 21.57,45.29 v21.79,45.29 | 20.65,31.34 v19.74,30.43 v18.59,29.29 | v16.08,101.75 v17.91,101.75 17.91,75.92 24.54,69.29 27.96,69.29 28.88,68.38 | 28.88,68.38 28.88,66.78 27.74,65.63 RPI2.17 27.51,65.41 26.37,64.26 24.31,64.26 v22.25,62.21 | v98.37,58.09 v97,58.09 | v72.31,76.61 v73.91,78.21 65.91,86.21 65.91,87.35 | 65.91,87.35 v65.91,87.81 65.91,88.95 69.34,92.38 v69.8,92.38 72.77,92.38 v73.69,91.47 | 28.88,68.38 40.08,68.38 59.05,87.35 65.91,87.35
3SCL
  Top 0.254: P4.4 96.09,111.35 96.09,111.58 95.86,111.81 92.66,111.81 78.49,97.64 78.49,94.89 76.2,92.61 73.69,92.61 70.94,89.87 R16.1 71.17,89.87 69.11,91.92 67.74,91.92 U6.11
3SDA  (via drill 0.33)
  Top 0.254: P4.3 95.63,111.12 95.63,110.67 96.09,110.21 96.55,110.21 97.46,109.3 97.46,105.41 81.92,89.87 75.74,89.87 R15.1 75.51,89.87 v74.6,90.78 | v69.11,90.78 68.66,91.24 67.74,91.24 U6.10
  Bottom 0.254: v74.6,90.78 v69.11,90.78
4.096V  (via drill 0.33)
  Top 0.254: v12.88,77.98 13.11,77.75 13.11,77.06 REF1.2 | v16.99,109.75 16.99,111.12 ADC1.2
  Top 0.305: ADC1.2 16.94,113.35 C14.1 C11.1
  Bottom 0.254: v12.88,77.98 12.88,108.38 14.48,109.98 16.76,109.98 v16.99,109.75
4SCL
  Top 0.254: 62.71,96.04 62.71,92.15 62.48,91.92 62.03,91.92 U6.14 | 62.71,96.04 62.71,97.87 64.77,99.92 65.23,99.92 P5.4 | 62.71,96.04 66.6,96.04 68.89,93.75 70.94,93.75 R18.1
4SDA
  Top 0.254: 65.91,100.38 65.91,99.7 65.68,99.47 65.46,99.47 P5.3 | 65.91,100.38 65.68,100.61 64.77,100.61 62.03,97.87 62.03,92.61 U6.13 | 65.91,100.38 66.37,100.84 69.34,100.84 70.03,100.15 70.03,98.78 75.06,93.75 75.51,93.75 R17.1
5V  (via drill 0.35)
  Top 0.254: D4.A 31.39,27.92 29.34,27.92 U$59.1
  Top 0.305: C21.+ v39.37,62.23 | v78.11,52.71 R1.1 | L1.1 35.56,49.78 35.56,49.93
  Top 0.762: C23.1 35.56,41.91
  Top 2.286: 35.56,41.91 J10.2
  Top 2.54: 35.56,49.93 35.56,41.91 | L1.1 35.79,61.63 C21.+
  Bottom 0.254: U$59.1 29.34,28.14 29.34,29.06 35.51,35.23 35.51,39.35 J10.2 35.51,39.57 34.82,39.57
  Bottom 0.305: v39.37,62.23 67.47,62.23 68.03,61.67 70.41,61.67 78.74,53.34 v78.11,52.71
11SCL  (via drill 0.33)
  Top 0.254: v12.88,37.97 13.34,38.43 14.48,38.43 U7.7 | v12.88,42.55 14.02,43.69 14.25,43.69 17.45,46.89 20.19,46.89 R32.1
  Bottom 0.254: J3.3 3.96,8.48 5.56,10.08 5.56,21.97 12.88,29.29 v12.88,37.97 v12.88,42.55
11SDA  (via drill 0.33)
  Top 0.254: v13.56,39.12 14.48,39.12 U7.6 | v13.56,44.37 16.08,46.89 R31.1
  Bottom 0.254: v13.56,44.37 v13.56,39.12 13.56,29.29 6.02,21.74 6.02,7.11 3.96,5.06 J3.4
12V  (via drill 0.33)
  Top 0.254: v11.28,82.55 14.71,79.12 R11.1 | D2.A 31.39,30.43 29.34,30.43 U$40.1 | C19.1 67.74,52.15 68.76,53.16 | v78.03,55.12 75.51,55.12 73,52.6 70.94,52.6 69.85,52.07 | J1.1 8.08,82.55 14.02,88.49 19.74,88.49 22.25,91.01 22.25,95.58 22.48,95.81 24.08,95.81 24.31,95.58 24.54,95.58 24.99,95.12 25.68,95.12 25.91,94.89 26.82,94.89 27.05,95.12 27.51,95.12 27.96,95.58 28.19,95.58 28.42,95.81 42.82,95.81 68.66,69.98 SP2.1
  Top 1.016: 62.94,53.24 VREG1.5
  Top 1.27: 63.25,53.24 63.25,57.14 C20.1
  Top 2.54: C22.+ 66.74,30.48 66.04,30.48 66.04,27.67 J5.PWR 68.58,35.61 69.67,36.7 69.67,51.89 69.85,52.07 68.76,53.16 67.95,53.98 63.98,53.98 63.25,53.24 62.94,53.24
  Bottom 0.254: J6.1 3.96,124.38 5.56,122.78 5.56,116.84 3.96,115.24 3.96,110.67 J4.1 3.96,110.44 3.96,109.07 5.56,107.47 5.56,98.32 3.96,96.72 J2.1 3.96,96.5 3.96,95.12 5.56,93.52 5.56,82.55 | J1.1 5.56,82.55 | 5.56,82.55 v11.28,82.55 | v78.03,55.12 78.03,60.6 68.89,69.75 SP2.1 | U$40.1 29.11,30.43 29.11,29.52 27.96,28.37 27.96,27.69 28.88,26.77 29.57,26.77 39.85,37.06 39.85,38.2 44.2,42.55 57.45,42.55 68.43,31.57 68.43,25.17 J5.PWR
22SCL
  Top 0.254: 3.28,37.29 14.48,37.29 U7.9 | 3.28,37.29 2.13,36.14 2.13,27.92 3.73,26.31 J8.3 | 3.28,37.29 1.68,38.89 1.68,61.98 3.05,63.35 4.65,63.35 6.93,61.06 20.88,61.06 21.79,60.15 21.79,53.06 20.19,51.46 R34.1
22SDA  (via drill 0.33)
  Top 0.254: v16.76,36.37 15.39,37.74 14.71,37.74 U7.8 | v8.31,22.89 3.96,22.89 J8.4 | v16.08,49.86 16.08,51.23 R33.1
  Bottom 0.254: v16.76,36.37 16.76,31.34 16.08,30.66 | v8.31,22.89 16.08,30.66 | v16.08,49.86 16.08,41.4 15.39,40.72 15.39,31.34 16.08,30.66
33SCL  (via drill 0.33)
  Top 0.254: v3.05,35.92 14.48,35.92 U7.11 | R36.1 16.08,60.38 5.33,60.38 3.96,61.75 J9.3
  Bottom 0.254: v3.05,35.92 3.05,38.43 1.68,39.8 1.68,69.75 2.36,70.43 5.11,70.43 5.56,69.98 5.56,63.58 3.96,61.98 J9.3
33SDA  (via drill 0.33)
  Top 0.254: v12.19,36.6 14.48,36.6 U7.10 | 7.62,54.43 v7.62,50.55 | 7.62,54.43 3.96,58.09 J9.4 | 7.62,54.43 11.96,58.78 16.31,58.78 17.68,60.15 20.19,60.15 R35.1
  Bottom 0.254: v12.19,36.6 12.19,45.97 v7.62,50.55
A0_PC
  Top 0.254: U6.1 67.51,85.29 67.06,85.29 65.23,83.46 R19.1
A1_PC
  Top 0.254: U6.2 67.51,85.98 66.14,85.98 64.08,83.92 64.08,78.44 R20.1
A2_PC
  Top 0.254: U6.21 61.8,87.35 59.51,87.35 59.28,87.12 59.28,84.15 59.97,83.46 60.66,83.46 R25.1
A3_PC
  Top 0.254: U7.1 14.71,42.32 15.39,42.32 17.91,39.8 17.91,36.14 19.28,34.77 19.51,34.77 20.88,33.4 20.88,30.66 R39.1
A4_PC
  Top 0.254: U7.2 14.48,41.86 14.02,41.86 13.56,42.32 13.56,42.55 14.25,43.23 21.57,43.23 22.48,42.32 22.48,39.12 24.99,36.6 26.37,36.6 28.88,34.09 R40.1
A5_PC
  Top 0.254: U7.21 20.65,40.49 21.11,40.49 22.02,39.57 22.02,36.6 24.54,34.09 R41.1
ADC1
  Top 0.254: R26.2 14.71,87.58 11.96,84.84 11.73,84.84 5.56,78.66 5.56,77.29 3.96,75.69 J1.3
ADC2
  Top 0.254: R28.2 14.71,93.52 7.85,93.52 3.96,89.64 J2.3
ADC3
  Top 0.254: R27.2 14.71,97.64 9.68,97.64 3.96,103.35 J4.3
ADC4
  Top 0.254: R37.2 14.02,120.04 6.48,120.04 3.96,117.53 J6.3
GND  (via drill 0.33)
  Top 0.254: 23.16,30.43 24.08,30.43 25.68,28.83 | 23.16,30.43 22.94,30.43 R39.2 | 25.68,28.83 29.11,25.4 U$31.1 | 25.68,28.83 30.02,33.17 30.02,34.77 29.11,35.69 R40.2 | 19.96,29.06 19.05,29.97 19.05,30.89 16.99,32.94 16.99,33.4 C8.2 | 19.96,29.06 21.79,29.06 23.16,30.43 | 19.96,29.06 15.39,24.49 15.39,19.23 J11.1 | 3.96,12.14 J3.2 | 15.16,19 J11.1 | J8.2 3.96,29.97 9.22,29.97 14.48,35.23 U7.12 | C11.2 18.59,116.61 19.28,117.3 19.28,120.96 18.36,121.87 C17.2 18.14,122.1 17.22,123.01 13.56,123.01 11.73,121.18 3.96,121.18 J6.2 3.73,120.96 3.73,119.58 2.13,117.98 2.13,108.61 3.73,107.01 J4.2 | ADC1.3 16.31,111.12 16.31,109.3 16.54,109.07 17.45,109.07 17.68,109.3 17.68,111.12 ADC1.1 | 15.85,100.84 16.31,100.84 16.76,101.3 16.76,102.67 14.94,104.5 14.94,105.18 ADC1.12 | 15.85,100.84 14.94,100.84 C15.2 | 19.05,93.98 C16.2 | 19.05,93.98 20.19,95.12 20.19,96.27 C5.2 C9.2 | 15.85,100.84 15.85,97.18 15.16,96.5 13.79,96.5 13.79,95.12 | 13.79,95.12 14.48,94.44 18.59,94.44 19.05,93.98 | J1.2 3.73,79.12 3.73,79.58 2.13,81.18 2.13,91.24 3.73,92.84 J2.2 3.96,93.07 6.02,95.12 13.79,95.12 | 94.53,85.33 93.57,84.38 93.57,66.09 97.69,61.98 97.69,56.03 97,55.35 94.49,55.35 93.57,56.26 93.57,59 94.49,59.92 94.52,59.94 | REF1.3 14.02,74.78 6.71,74.78 2.13,70.21 2.13,67.01 3.73,65.41 J9.2 3.96,65.18 | R20.2 64.08,76.61 65,77.52 65,81.64 R19.2 | R25.2 60.88,81.64 60.88,79.58 63.86,76.61 R20.2 | 19.05,85.29 14.94,85.29 R5.2 | 19.05,85.29 C4.2 19.05,87.58 22.94,87.58 | 19.05,85.29 C1.2 | v66.37,96.72 66.37,97.41 66.35,97.55 | v66.14,95.35 66.14,93.98 C7.2 | 77.57,57.15 77.57,60.6 Q2.2 77.34,60.83 77.34,63.58 64.54,76.38 64.08,76.38 R20.2
  Top 0.254: R2.2 79.86,48.26 81,49.4 83.97,49.4 85.09,49.93 | 86.42,42.84 94.26,35 P1.1 | v92.43,110.44 94.26,110.44 94.3,110.48 | R46.2 34.82,34.32 38.71,30.43 R12.1 38.94,30.2 38.94,28.14 R23.1 39.17,27.92 39.17,22.89 R45.1 39.17,22.66 39.17,20.37 R3.1 38.94,20.14 35.74,16.94 20.42,16.94 18.36,19 15.39,19 J11.1 | v94.26,87.58 94.26,85.75 P3.1
  Top 0.305: ADC1.1 17.59,112.58 C14.2 C11.2 | REF1.3 14.42,75.17 C18.2 | U6.12 67.61,92.48 C7.2 | P5.7 66.94,98.62 67.22,98.62 67.67,98.16 C6.2 67.97,97.55 66.35,97.55 65.82,98.09 P5.1 | C3.2 94.92,108.92 P4.7 94.81,109.7 94.81,109.98 94.3,110.48 94.28,110.51 P4.1 | P3.1 94.52,85.62 94.52,85.34 94.53,85.33 95.05,84.81 P3.7 95.17,84.06 95.17,83.79 96.15,82.81 C2.2 | P2.1 94.52,60.22 94.52,59.94 95.05,59.41 P2.7 95.17,58.67 95.17,58.39 96.28,57.28 C12.2 | P1.1 94.39,34.82 94.39,34.54 94.92,34.01 P1.7 95.04,33.27 95.04,32.99 96.15,31.88 C10.2 | C8.2 15.07,35.29 U7.12 | RPI2.14 25.45,60.92 26.32,61.79 28,61.79 28.7,62.49 28.7,63.45 29.51,64.25
  Top 0.635: R46.2 41.54,41.15 C23.2
  Top 0.762: C23.2 42.92,43.29 45.61,43.29 | 25.45,60.92 24.8,61.56 24.38,61.56 23.55,62.39 23.55,62.81 21.67,64.69 20.13,64.69 19.51,65.31 J9.2 0.96,62.44 0.96,38.59 1.27,38.29 1.27,12.7 2,11.97 J3.2 8.13,11.97 15.16,19
  Top 1.016: 63.5,45.72 63.35,45.72 VREG1.1
  Top 1.27: 59.69,58.42 60.96,58.42 60.96,54.24 60.83,54.11 60.83,47.14 61.52,46.46 62.76,46.46 63.5,45.72 62.59,45.72 60.16,43.29 45.61,43.29 41.91,46.99 41.91,59.25 C21.- 46.16,60.96 53.34,60.96 55.49,60.96 D3.A 59.69,58.42 | C20.2 60.59,59.32 59.69,58.42 | 48.26,64.97 38.1,75.13 38.1,78.74 36.83,80.01 29.21,80.01
  Top 2.032: 66.04,45.72 63.5,45.72 | 53.34,60.96 49.53,64.77 49.53,64.97
  Top 2.54: C22.- 66.93,40.64 | 66.93,40.64 66.93,44.83 66.04,45.72 | 66.93,40.64 63.5,37.21 63.5,31.82 63.3,31.62 63.3,24.41 J5.GND 70.28,19.13 J5.GNDBREAK 73.28,29.7 86.42,42.84 87.33,43.74 87.33,47.7 85.09,49.93 85.09,54.61 82.55,57.15 77.57,57.15 67.31,57.15 59.49,64.97 49.53,64.97 48.26,64.97 34.3,64.97 33.58,64.25 29.51,64.25
  Bottom 0.254: J7.2 3.96,47.35 3.96,46.2 5.56,44.6 5.56,31.57 3.96,29.97 J8.2 | J4.2 3.73,106.78 3.73,105.64 2.13,104.04 2.13,94.67 3.73,93.07 J2.2 | RPI2.39 27.74,93.52 29.57,95.35 v66.14,95.35 66.37,95.58 v66.37,96.72 70.03,100.38 78.49,100.38 81.23,103.12 | v92.43,110.44 88.54,110.44 81.23,103.12 | v94.26,87.58 94.26,90.09 81.23,103.12 | J1.2 3.96,78.89 8.99,78.89 20.42,67.46 24.31,67.46 24.77,67.92 RPI2.20
  pour Top (isolate 0.254, no thermals): 25.4,49.53 22.86,49.53 22.86,95.25 29.21,95.25 29.21,50.8 26.67,50.8
  pour Top (isolate 0, rank 2): -3.81,130.81 119.38,130.81 119.38,6.35 19.89,6.35 arc45 18.45,5.75 12.7,0 -2.54,0 -2.54,128.7 arc45 -3.14,130.14
  pour Bottom (isolate 0): -5.08,133.35 116,133.35 arc-45 117.44,132.75 119.38,130.81 119.38,12.7 112.36,5.68 arc-45 110.92,5.08 19.05,5.08 14.57,0.6 arc-45 13.13,0 -3.81,0 -3.81,131.24 arc45 -4.41,132.68
GND1  (via drill 0.35)
  Top 0.635: R46.1 34.15,35.56 34.22,35.56 34.29,35.63 v34.29,36.83
  Bottom 0.635: v34.29,36.83 29.72,36.83 RPI2.41
GPIO12
  Top 0.254: R24.2 70.71,59.46 67.28,59.46 44.65,82.09 27.05,82.09 26.82,82.32 26.59,82.32 26.37,82.09 26.14,82.09 24.99,83.24 RPI2.32
N$2
  Top 0.254: R12.2 36.88,30.43 34.59,30.43 D2.C
N$6  (via drill 0.33)
  Top 0.254: v64.54,48.72 63.86,49.4 62.94,49.4 VREG1.3 | v60.43,45.75 58.83,45.75 55.63,48.95 VREG1.6
  Top 2.54: 53.86,50.28 VREG1.6 | D3.C 52.07,56.76 52.07,50.8 53.34,49.53 VREG1.6 | L1.2 52.05,49.55 52.07,49.53 VREG1.6
  Bottom 0.254: v64.54,48.72 63.4,48.72 v60.43,45.75
N$7
  Top 0.762: C19.2 65.29,50.28 64.34,51.23 VREG1.4
N$8
  Top 0.254: R3.2 37.11,20.37 34.59,20.37 D1.C
N$9
  Top 0.254: SP2.2 69.11,62.89 76.43,62.89 Q2.3
N$10
  Top 0.254: Q2.1 75.29,60.6 73.91,60.6 72.77,59.46 R24.1
N$11  (via drill 0.33)
  Top 0.254: R1.2 74.83,52.6 74.83,48.26 R2.1 74.6,48.26 74.37,48.03 v73.69,48.03 | v67.74,48.03 62.94,48.03 VREG1.2
  Bottom 0.254: v73.69,48.03 v67.74,48.03
N$12
  Top 0.254: C1.1 19.05,83.24 19.28,83.01 19.28,80.95 R4.2 19.51,80.72 20.42,79.81 20.42,76.61 19.96,76.15 7.39,76.15 5.11,73.86 3.28,73.86 1.68,75.46 1.68,103.58 3.28,105.18 4.19,105.18 10.14,111.12 12.88,111.12 ADC1.8
N$13
  Top 0.254: R5.1 14.94,83.24 14.94,80.95 R11.2 14.94,80.72 16.54,79.12 19.28,79.12 R4.1
N$15
  Top 0.254: R23.2 37.11,28.14 34.59,28.14 D4.C
N$16
  Top 0.254: R45.2 37.11,22.89 34.59,22.89 D5.C
N$18
  Top 0.254: 19.05,89.41 14.94,89.41 R26.1 | 19.05,89.41 20.65,91.01 20.65,104.72 17.45,107.93 16.99,107.93 15.62,109.3 15.62,111.12 ADC1.4 | 19.05,89.41 C4.1
N$19
  Top 0.254: 17.22,95.81 14.94,95.81 R27.1 | 17.22,95.81 19.05,95.81 C5.1 | 17.22,95.81 17.22,102.21 18.36,103.35 18.36,106.32 17.22,107.47 15.62,107.47 14.25,108.84 14.25,111.12 ADC1.6
N$20  (via drill 0.33)
  Top 0.254: C16.1 19.05,91.69 14.94,91.69 R28.1 14.71,91.69 v13.56,92.84 | v14.94,109.3 14.94,111.12 ADC1.5
  Bottom 0.254: v14.94,109.3 14.94,106.1 13.56,104.72 v13.56,92.84
N$22
  Top 0.254: R37.1 14.25,121.87 16.54,121.87 18.14,120.27 C17.1 18.14,120.04 13.79,115.7 13.79,111.35 ADC1.7
N$23  (via drill 0.33)
  Top 0.254: v20.88,74.09 20.88,72.49 R38.2 | v17.68,104.04 17.68,105.18 ADC1.16
  Bottom 0.254: v20.88,74.09 20.88,100.84 v17.68,104.04
N$24  (via drill 0.33)
  Top 0.254: v22.02,69.52 21.11,69.52 R43.2 | v16.54,104.04 16.99,104.5 16.99,105.18 ADC1.15
  Bottom 0.254: v22.02,69.52 22.02,71.12 15.39,77.75 15.39,102.9 v16.54,104.04
N$25  (via drill 0.33)
  Top 0.254: v20.88,68.15 20.88,66.55 R44.2 | v16.31,106.78 16.31,105.41 ADC1.14
  Bottom 0.254: v20.88,68.15 20.88,71.58 14.94,77.52 14.94,105.41 v16.31,106.78
PI_5V_POWER  (via drill 0.35)
  Top 0.254: 32.83,20.37 31.62,20.37 D1.A | 29.11,17.78 29.11,20.14 U$64.1 | 3.96,68.83 8.53,73.41 19.05,73.41 20.88,75.23 20.88,83.24 19.74,84.38 11.96,84.38 10.59,83.01 10.59,81.41 14.94,77.06 REF1.1
  Top 0.305: 29.82,44.24 29.61,44.45 28.45,44.45 28,44.01 26.16,44.01 RPI2.2 | REF1.1 15.07,76.97 C18.1 | J3.1 6.14,17.78 v10.16,17.78 | J9.1 3.86,68.83 3.96,68.83 | RPI2.4 24.97,47.6
  Top 1.016: J10.1 33.02,36.43 32.02,35.44 32.02,33.65 32.83,32.84 32.83,20.37 32.83,18.86 31.75,17.78 29.11,17.78 21.64,17.78 J11.2
  Top 2.032: 24.97,47.6 RPI2.2
  Top 2.286: J10.1 31.75,40.64
  Top 2.54: 31.75,40.64 31.75,44.45 30.48,45.72 29.82,45.72 29.82,44.24 29.62,44.04
  Bottom 0.254: 3.73,68.61 2.13,67.01 2.13,57.63 3.73,56.03 3.73,51.23 J7.1 3.73,51 2.13,49.4 2.13,40.03 3.73,38.43 3.73,33.4 | 3.73,33.17 2.13,31.57 2.13,22.2 3.73,20.6 3.73,15.57 J3.1
  Bottom 0.305: v10.16,17.78 13.97,21.59 17.83,21.59 J11.2 | 3.73,33.17 3.76,33.17 J8.1 3.73,33.35 3.73,33.4 | J9.1 3.83,68.7 3.73,68.61
  pour Top (isolate 0): 22.86,48.9 22.86,43.18 30.48,43.18 30.48,49.53 26.67,49.53 25.91,48.77 23.62,48.77 23.17,48.77 arc-45
RESET  (via drill 0.33)
  Top 0.254: U6.3 67.74,86.67 68.2,86.67 68.66,86.21 68.66,78.89 68.2,78.44 R6.2 68.2,78.21 v65.68,78.21 | v16.08,40.26 15.16,41.17 14.71,41.17 U7.3 | v16.08,31.8 16.08,30.66 R42.2 | v42.37,63.12 42.37,61.29 40.54,59.46 40.54,41.17 37.11,37.74 v34.14,37.74
  Bottom 0.254: v16.08,31.8 v16.08,40.26 16.08,40.72 21.34,45.97 22.25,45.97 24.31,43.92 27.51,43.92 29.79,41.63 29.79,40.72 32.77,37.74 v34.14,37.74 | v65.68,78.21 57.45,78.21 v42.37,63.12
SCL  (via drill 0.33)
  Top 0.254: v21.79,41.86 21.11,41.17 20.65,41.17 U7.22 | v22.71,43.92 22.71,44.37 23.16,44.83 23.16,46.89 v23.39,47.12 | v59.97,86.67 61.8,86.67 U6.22 | v37.57,67.01 31.85,72.72 R22.1
  Bottom 0.254: v21.79,41.86 21.79,43 v22.71,43.92 | v59.97,86.67 59.05,86.67 38.48,66.09 | 38.48,66.09 31.42,59.03 31.42,54 27.74,50.32 RPI2.5 | 38.48,66.09 v37.57,67.01
  Bottom 0.305: v23.39,47.12 23.78,47.5 23.78,48.23 24.63,49.09 25.46,49.09 26.66,50.28 RPI2.5
SDA  (via drill 0.33, 0.35)
  Top 0.254: v19.28,41.86 20.42,41.86 U7.23 | v21.79,44.37 22.02,44.37 22.71,45.06 v22.71,48.03 | 27.51,47.8 RPI2.3 | v59.97,84.61 61.34,85.98 61.8,85.98 U6.23 | v40.54,67.01 34.82,72.72 R21.1
  Top 0.305: v31.75,60.96 v33.03,59.68
  Bottom 0.254: v21.79,44.37 v19.28,41.86 | v59.97,84.61 59.97,83.92 41.91,65.86 | 41.91,65.86 35.65,59.6 31.88,55.83 31.88,51.94 27.74,47.8 RPI2.3 | v40.54,67.01 41.68,65.86 41.91,65.86
  Bottom 0.305: 22.86,48.26 22.86,48.18 v22.71,48.03 23.78,49.1 23.78,50.77 24.63,51.63 25.46,51.63 25.65,51.82 26.83,51.82 27.02,51.63 28.36,51.63 30.48,53.74 30.48,59.69 v31.75,60.96 | v33.03,59.68 35.57,59.68 35.65,59.6
SPI_MISO
  Top 0.254: R43.1 19.28,69.52 20.19,70.43 22.48,70.43 23.85,69.06 24.31,69.06 24.54,69.29 25.45,69.29 25.68,69.06 25.91,69.06 27.51,70.66 RPI2.21
SPI_MOSI
  Top 0.254: R44.1 19.28,66.55 20.42,65.41 22.25,65.41 24.08,67.23 24.54,66.78 25.45,66.78 26.59,67.92 27.51,67.92 RPI2.19
SPI_SCLK
  Top 0.254: R38.1 19.28,72.26 20.19,71.35 23.16,71.35 23.62,71.81 25.45,71.81 25.68,71.58 25.91,71.58 27.51,73.18 RPI2.23

### Text on the board
tPlace: 12V | GND | ADC4 | 4 | 12V | 4 | GND | ADC128 / S102 | ADC3 | 3 | 12V | GND | ADC2 | 2 | Airflow and Pressure Sensor / PI Hat / Project Tetra / Thomas Hudson / 6/27/2020 / v0.00.002 | PCA9548 | 3 | 12V | GND | ADC1 | 1 | Mass Airflow Sensors #1-4 | 5V | GND | BUZZ | SCL | SDA | 2 | 4 | Sensirion Sensors #1-4 | 5V | GND | SCL | SDA | PCA9548 | 3 | 5V | 12V | 1 | GND | 5V | SCL | DISPLAY | GND | GND | 5V | SDA | 3V | RPI / 5V | 2 | 5V | GND | SCL | SDA | 1